# EAGLE board OpenBCI_Board (EAGLE 9.7.0), part 1 of 3
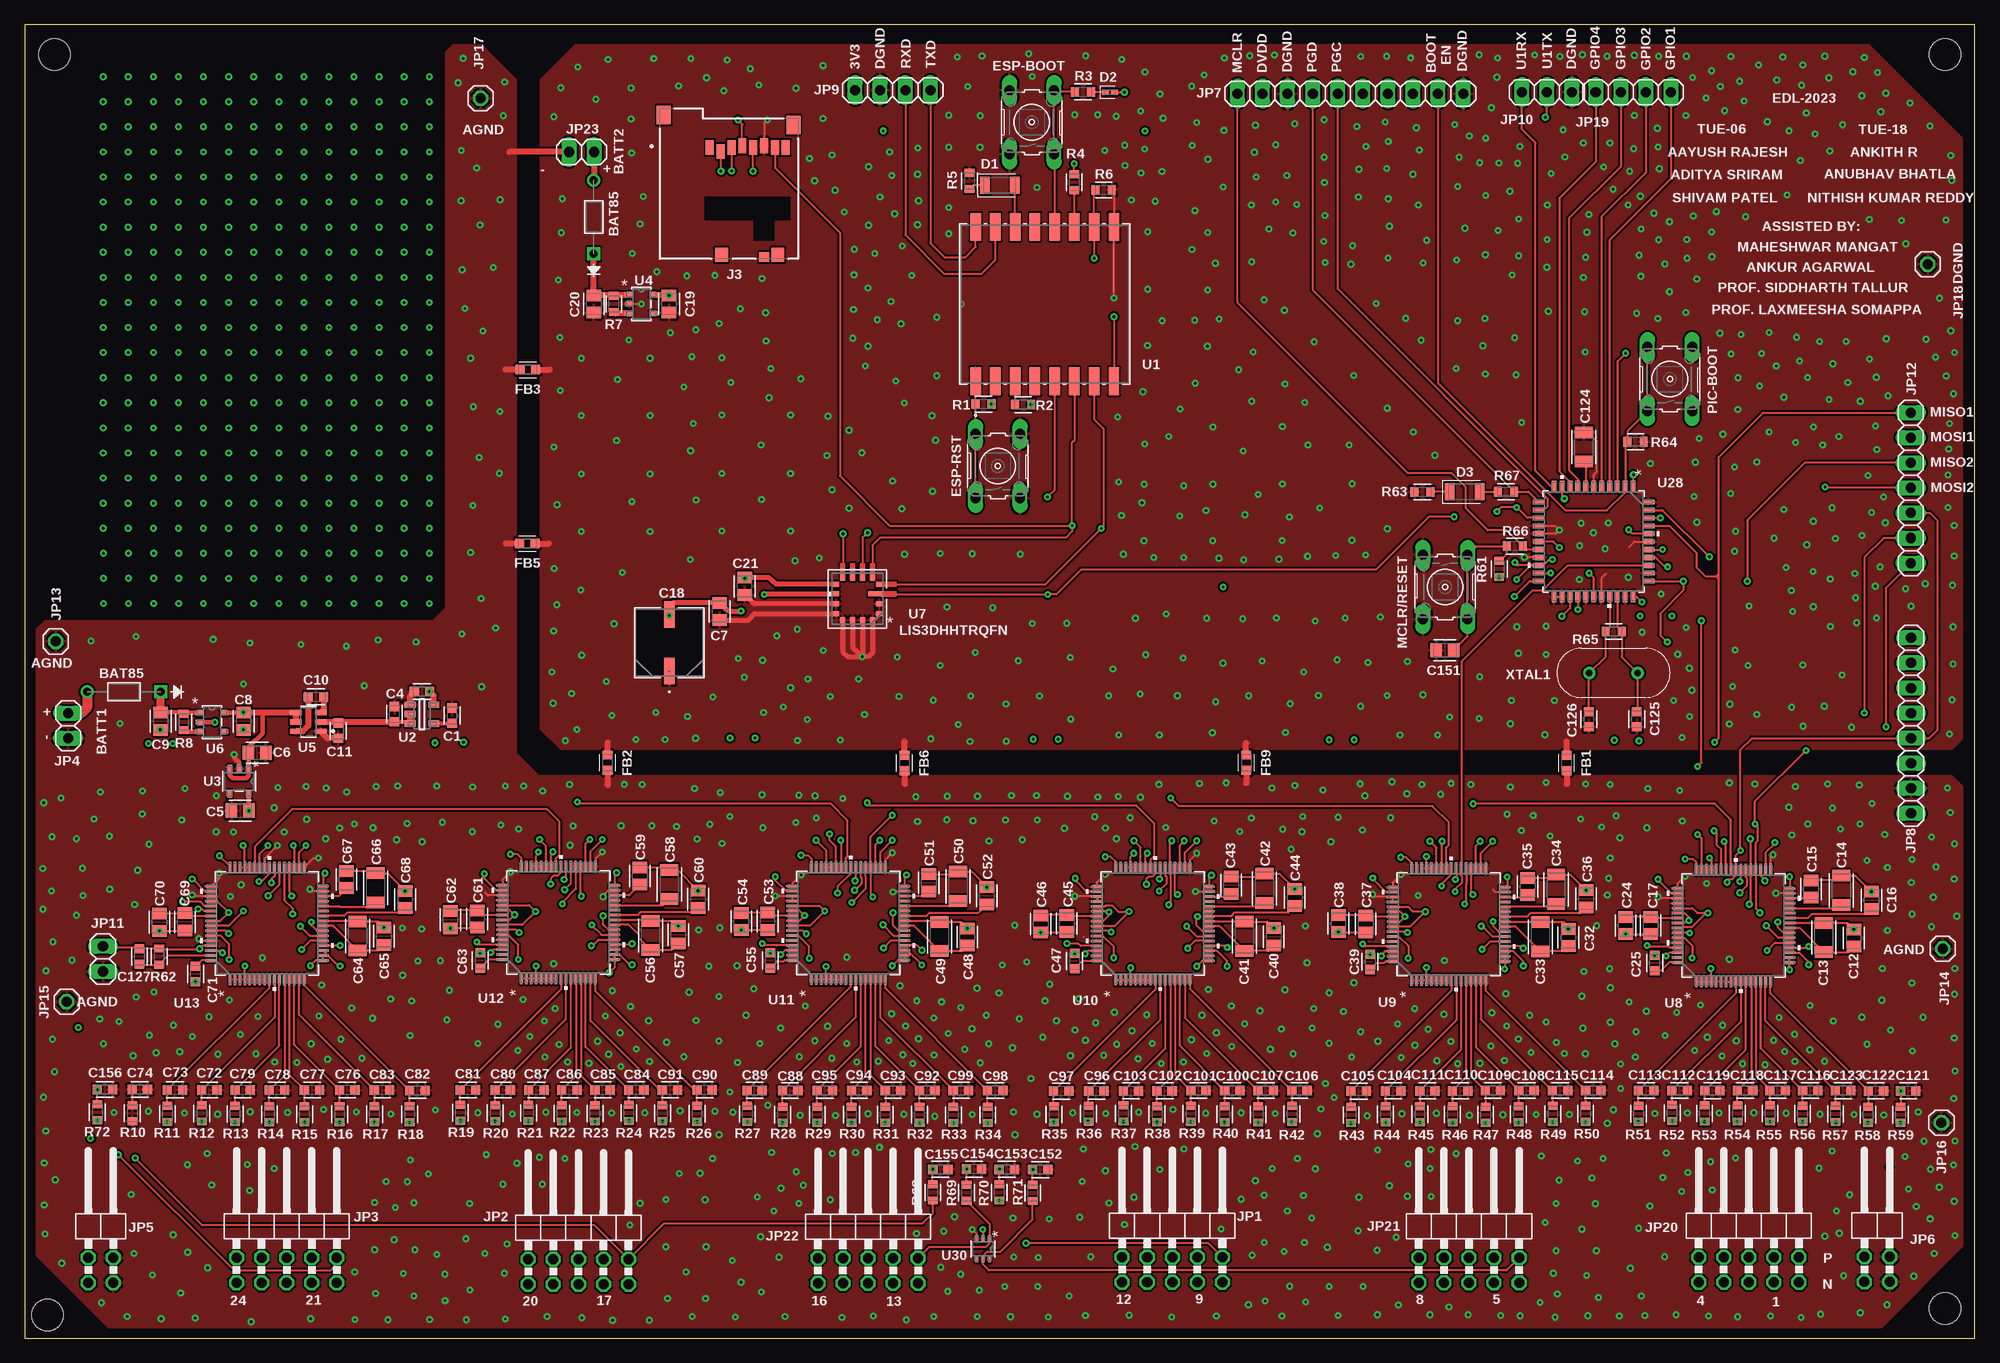
[diagram p5: board, top side]
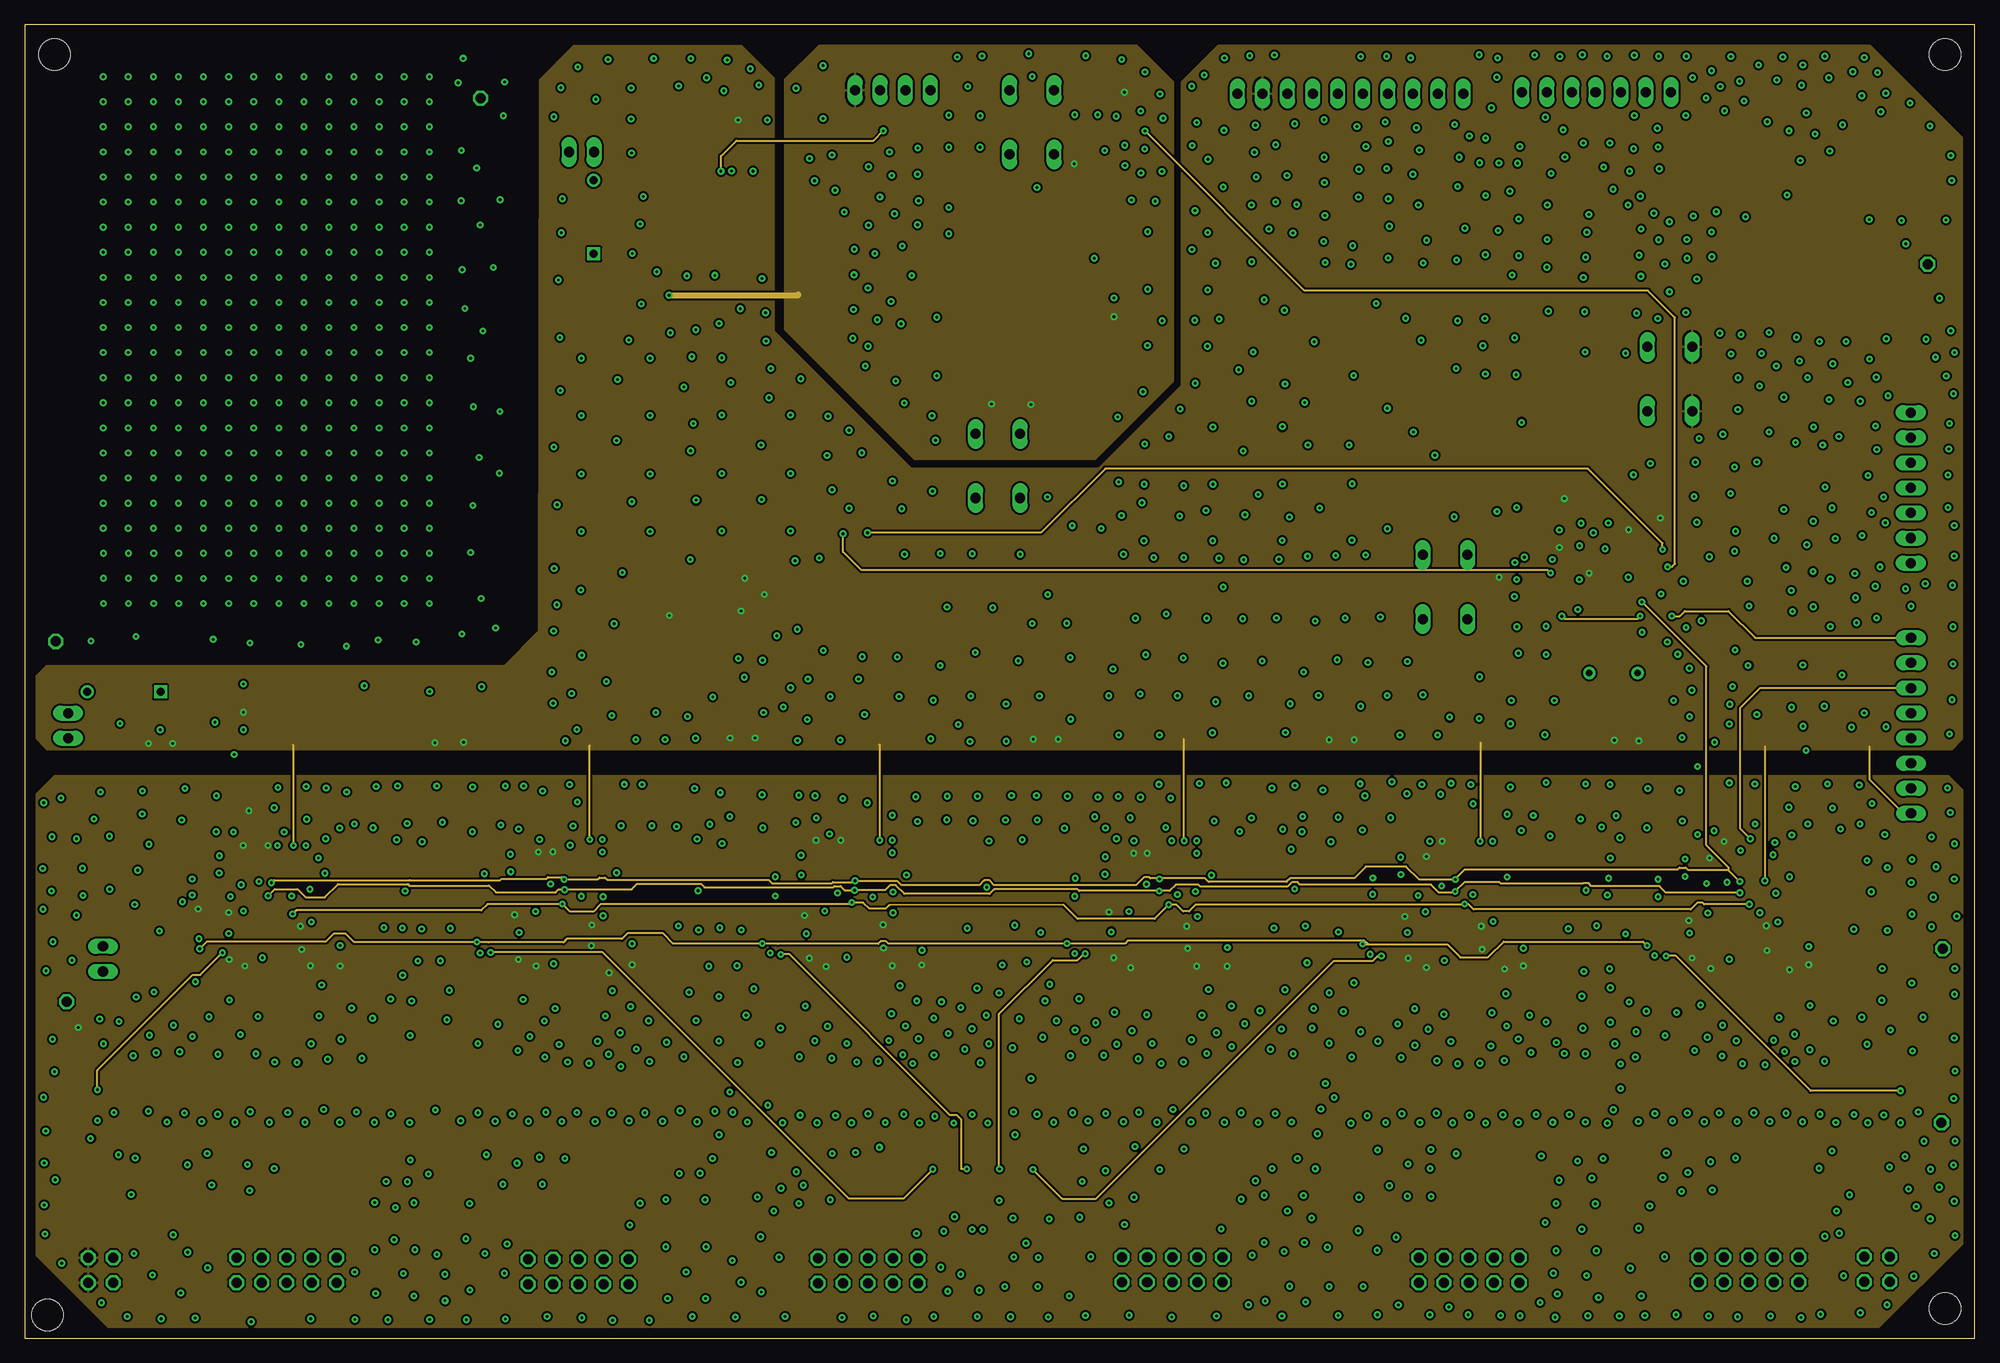
[diagram p6: board, inner layer Route2]
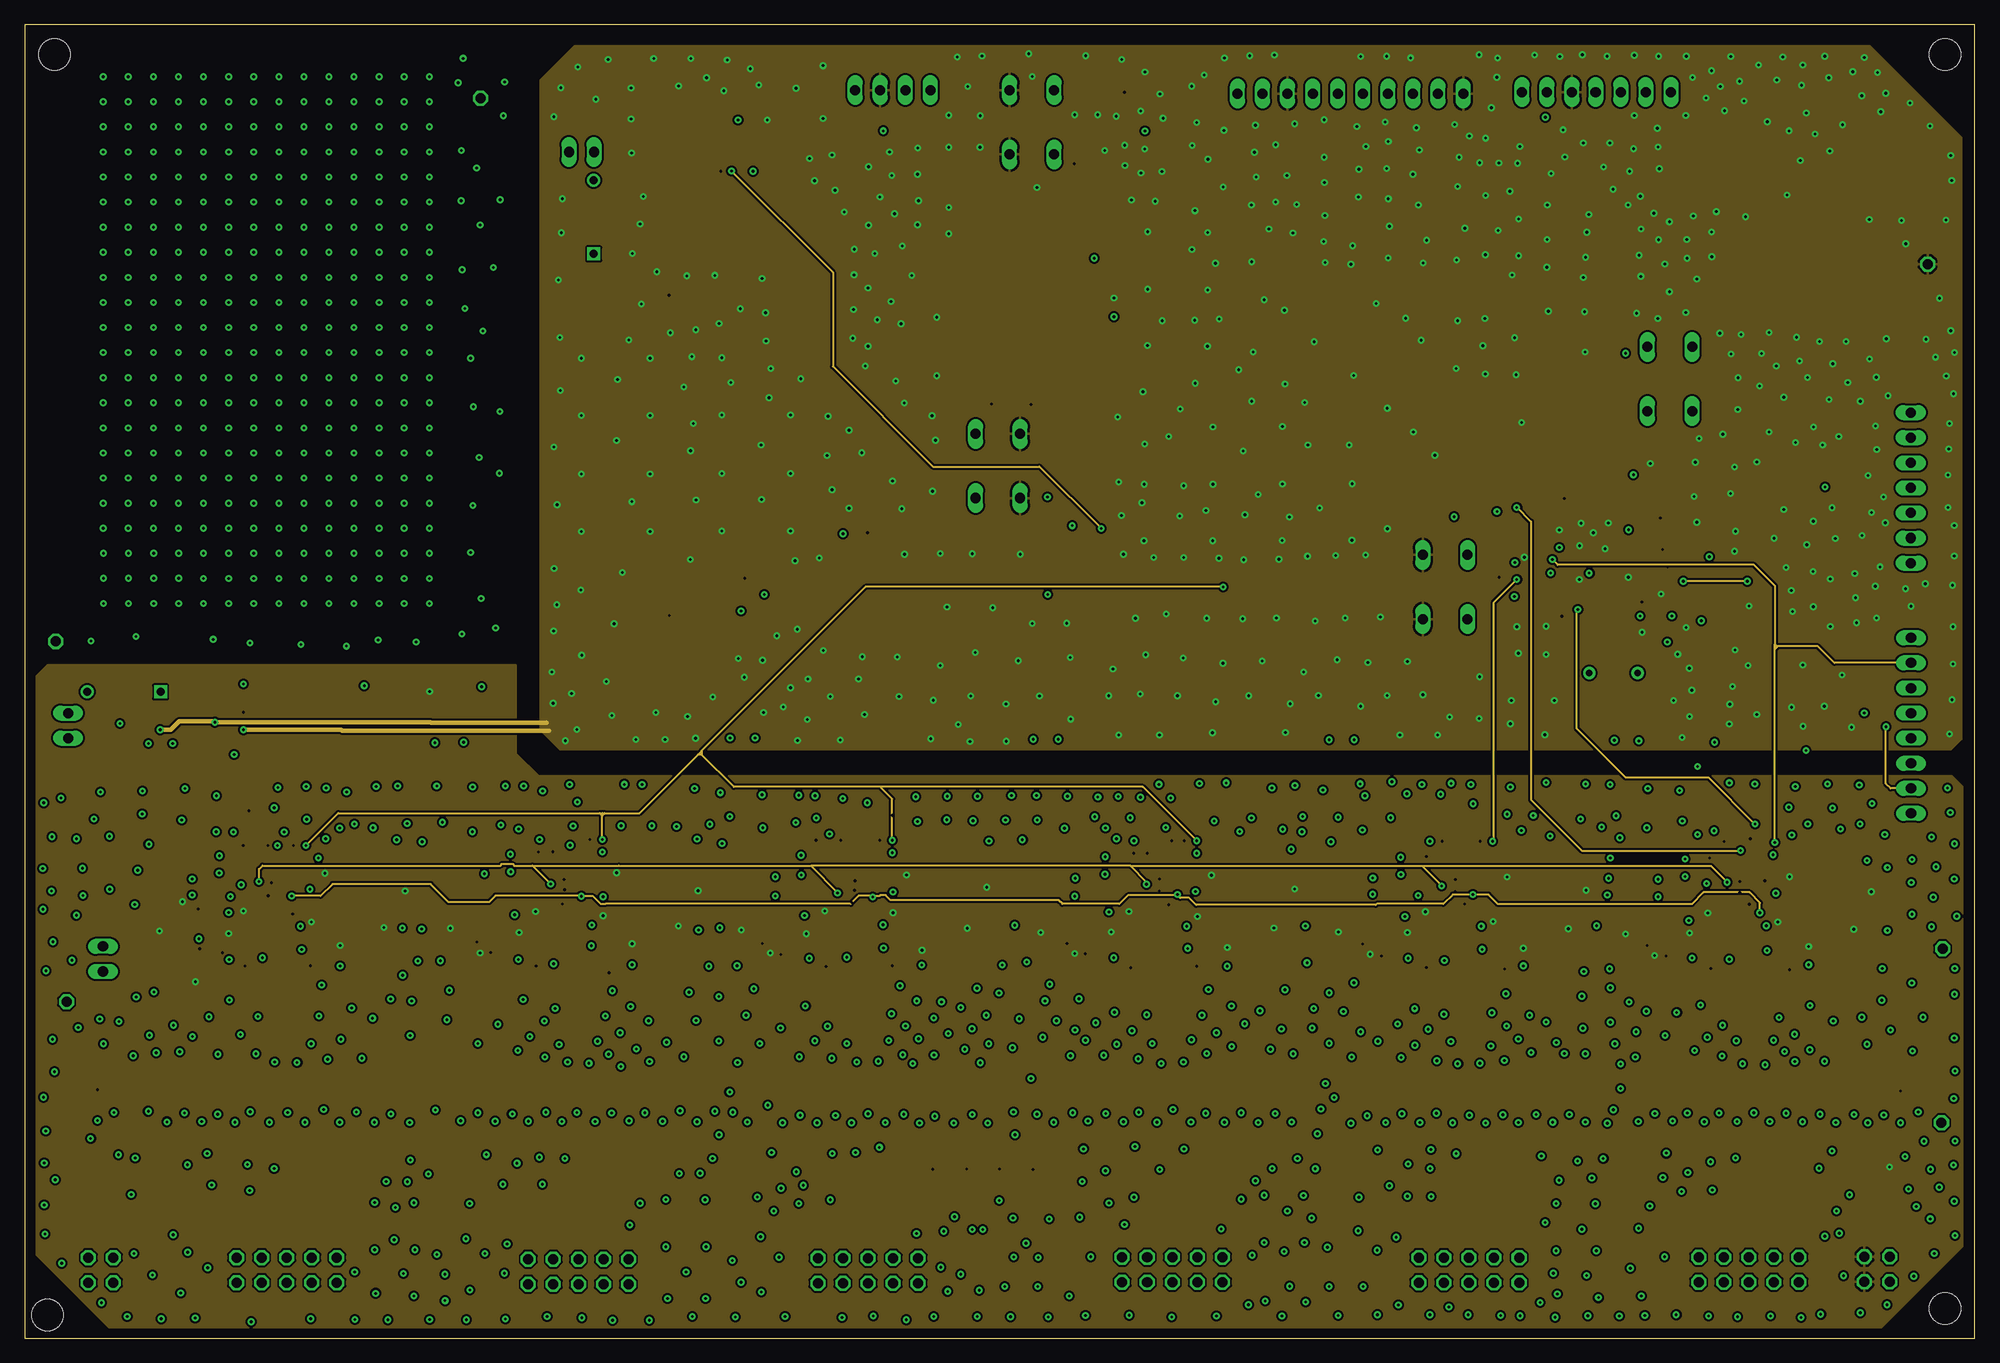
[diagram p7: board, inner layer Route15]
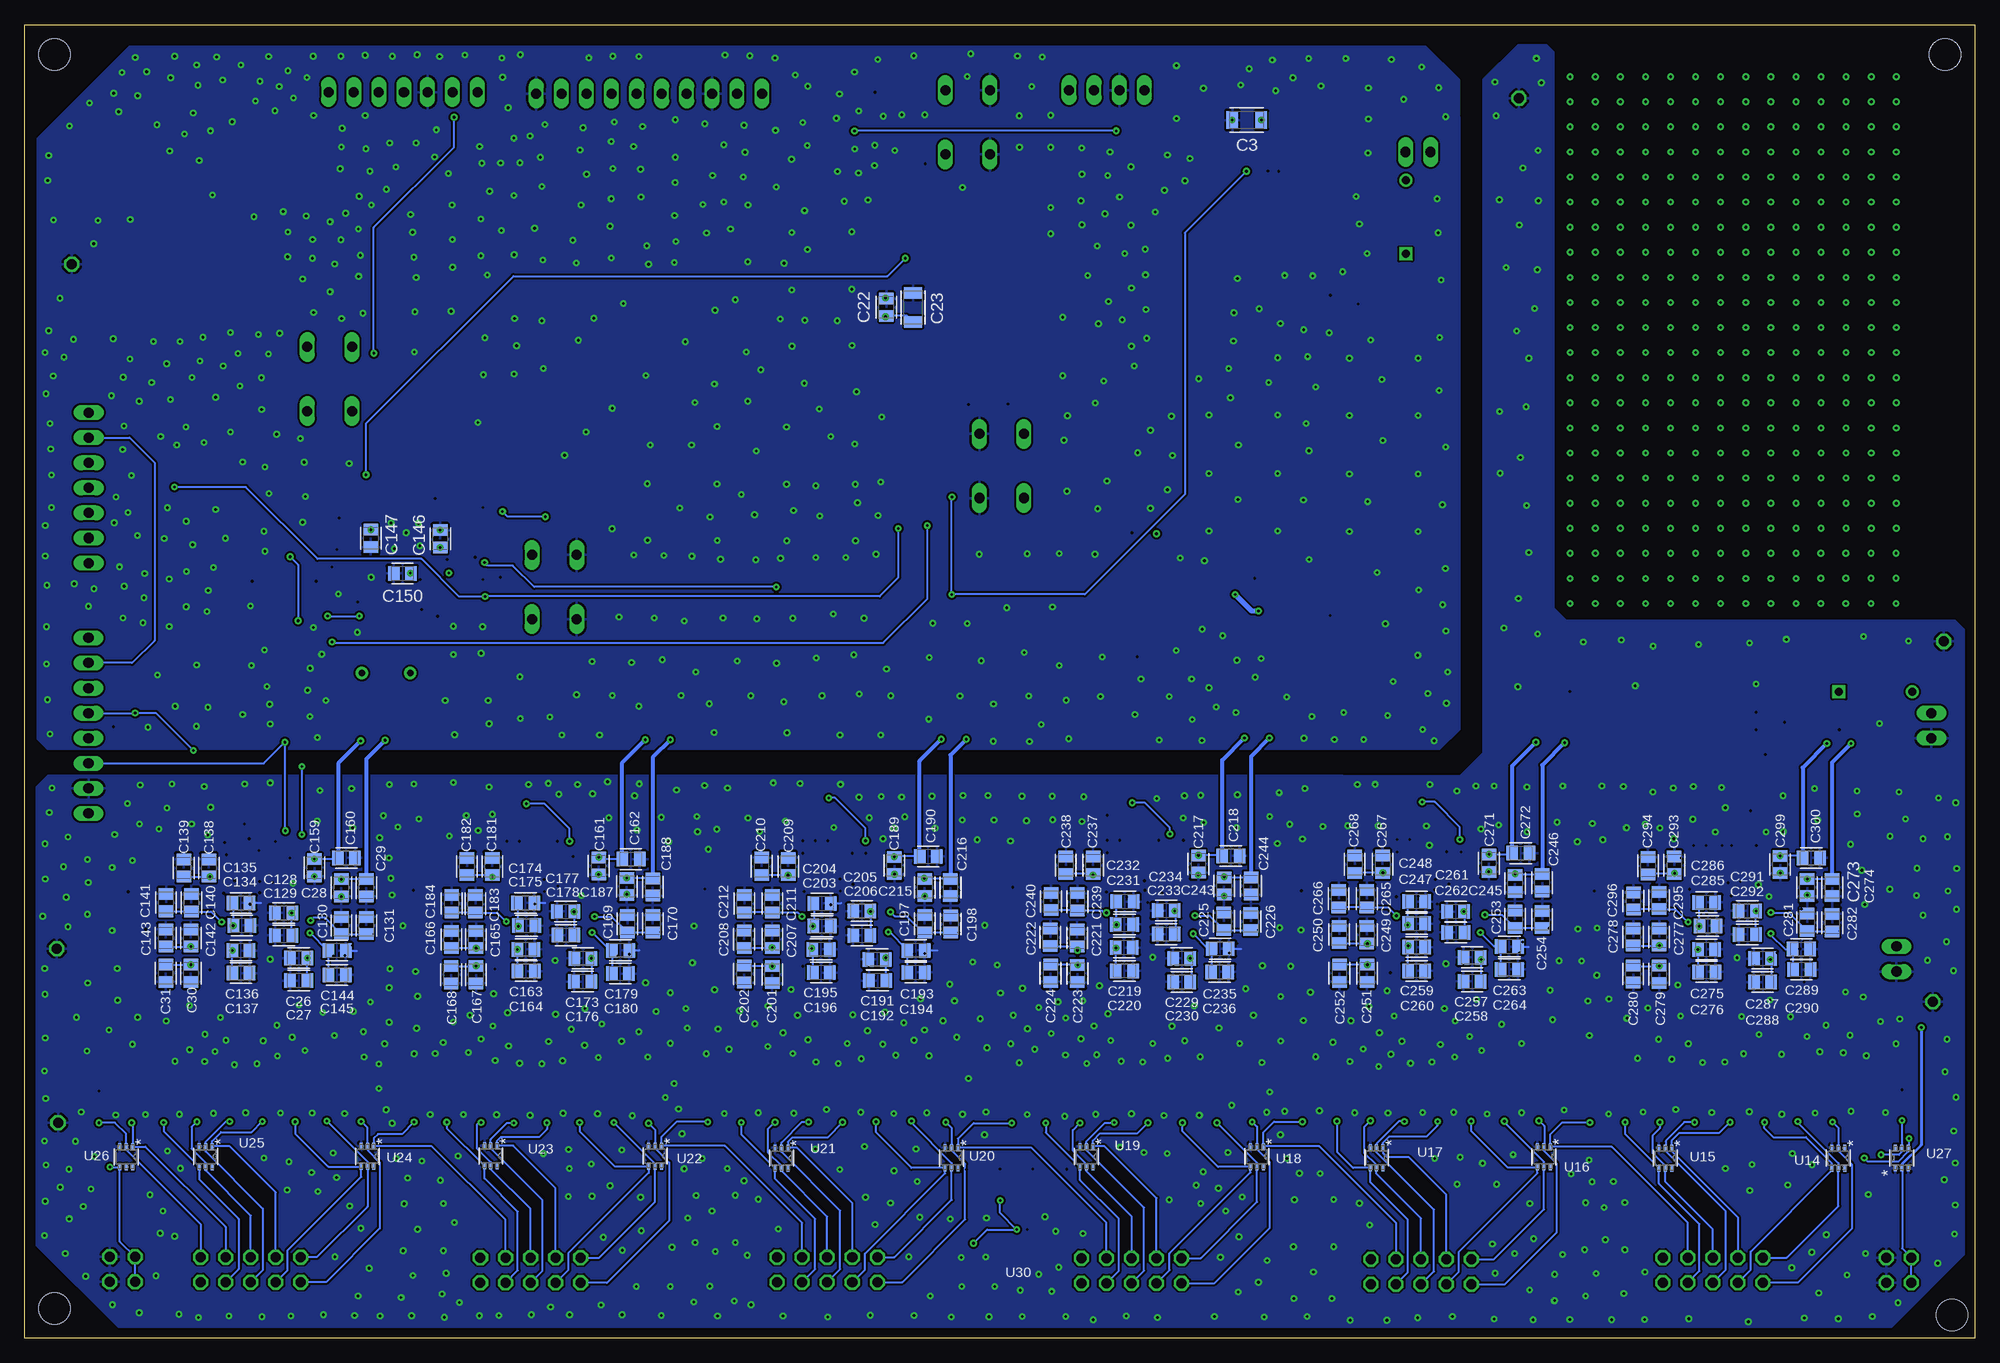
[diagram p8: board, bottom side, seen from below]

Size 197.5 x 133 mm. Coordinates in mm from the lower left corner, seen from the top.
Outline: 0,0 197.5,0 197.5,133 0,133 0,0
Copper layers (((1+2)*15)+16): Top 0.035mm / dielectric 1.5mm / Route2 0.035mm / dielectric 0.15mm / Route15 0.035mm / dielectric 0.2mm / Bottom 0.035mm
Design rules "default *": minimum track width 8mil, minimum drill 10mil, track to track 8mil, track to pad 8mil, pad to pad 8mil, via to via 8mil, smd to smd 8mil, copper to edge 40mil, drill to drill 10mil, minimum pad ring 10mil, minimum via ring 8mil, stop-mask expansion 4mil, vias tented up to drill 0mil, thermal gap 10mil
Holes 3.2 mm at 3,130 194.5,130 194.5,3 2.32,2.35

## Footprints (pad centres in the part's own frame; a part is rotated, then mirrored left to right if it is on the bottom)
CAPC1608X85 = smd 0.921 x 0.97: 1 -0.775,0; 2 0.775,0
CAPC3216X135 = smd 1.165 x 1.815: 1 -1.475,0; 2 1.475,0
CAPC2012X110 = smd 1.165 x 1.465: 1 -0.875,0; 2 0.875,0
CAP_MCVV_A1_MTC-L = smd 2.692 x 1.092: 1 -2.857,0; 2 2.857,0
DO-34_NEX = drill 0.813 pad 1.321 square: 1 0,0 | drill 0.813 pad 1.321: 2 7.442,0
LEDC3216X75N_FLAT-B = smd 0.962 x 1.712: A 1.525,0; C -1.525,0
LEDC1005X25N_FLAT-B = smd 0.7 x 0.5: A 0.45,0; C -0.45,0
B3F-10XX = drill 1.016 long: 1 -3.251,2.261; 2 3.251,2.261; 3 -3.251,-2.261; 4 3.251,-2.261
BEADC1608X95N = smd 0.9 x 0.97: 1 -0.785,0 | smd 0.933 x 0.97: 2 0.769,0
GCT_MEM2051-00-195-00-A_REVD1 = smd 1 x 0.95: CD -3.56,7.425 | smd 0.8 x 1.5: P1 1.94,-3.66; P2 0.84,-3.26; P3 -0.26,-3.66; P4 -1.36,-3.86; P5 -2.46,-3.66; P6 -3.56,-3.86; P7 -4.66,-3.66; P8 -5.76,-3.66 | smd 1.3 x 1.4: S1 -4.95,7.2; S2 0.75,7.2 | smd 1.4 x 1.9: S3 6.6,-6.95; S4 -6.55,-5.95
2X05/90 = drill 1.016 octagon: 1 -5.08,-6.35; 2 -5.08,-3.81; 3 -2.54,-6.35; 4 -2.54,-3.81; 5 0,-6.35; 6 0,-3.81; 7 2.54,-6.35; 8 2.54,-3.81; 9 5.08,-6.35; 10 5.08,-3.81
1X02 = drill 1.016 long: 1 -1.27,0; 2 1.27,0
2X02/90 = drill 1.016 octagon: 1 -1.27,-6.35; 2 -1.27,-3.81; 3 1.27,-6.35; 4 1.27,-3.81
1X10 = drill 1.016 long: 1 -11.43,0; 2 -8.89,0; 3 -6.35,0; 4 -3.81,0; 5 -1.27,0; 6 1.27,0; 7 3.81,0; 8 6.35,0; 9 8.89,0; 10 11.43,0
1X08 = drill 1.016 long: 1 -8.89,0; 2 -6.35,0; 3 -3.81,0; 4 -1.27,0; 5 1.27,0; 6 3.81,0; 7 6.35,0; 8 8.89,0
1X04 = drill 1.016 long: 1 -3.81,0; 2 -1.27,0; 3 1.27,0; 4 3.81,0
1X03 = drill 1.016 long: 1 -2.54,0; 2 0,0; 3 2.54,0
1X07 = drill 1.016 long: 1 -7.62,0; 2 -5.08,0; 3 -2.54,0; 4 0,0; 5 2.54,0; 6 5.08,0; 7 7.62,0
1X01 = drill 1.016 octagon: 1 0,0
RESC1608X60 = smd 0.799 x 0.974: 1 -0.815,0; 2 0.815,0
ESP-07S_RFS-L = smd 2.794 x 1.041: 1 -7.811,7; 2 -7.811,5; 3 -7.811,3; 4 -7.811,1; 5 -7.811,-1; 6 -7.811,-3; 7 -7.811,-5; 8 -7.811,-7; 9 7.811,-7; 10 7.811,-5; 11 7.811,-3; 12 7.811,-1; 13 7.811,1; 14 7.811,3; 15 7.811,5; 16 7.811,7
DBV0005A = smd 1.1 x 0.65: 1 -1.2,0.95; 2 -1.2,0; 3 -1.2,-0.95; 4 1.2,-0.95; 5 1.2,0.95
DDC5_TEX-L = smd 0.8 x 0.457: 1 -1.276,0.95; 2 -1.276,0; 3 -1.276,-0.95; 4 1.276,-0.95; 5 1.276,0.95
SOT_RG1_DIO-L = smd 0.8 x 0.457: 1 -1.251,0.95; 2 -1.251,0; 3 -1.251,-0.95; 4 1.251,-0.95; 5 1.251,0.95
SOT95P280X145-6N = smd 1.21 x 0.58: 1 -1.255,0.95; 2 -1.255,0; 3 -1.255,-0.95; 4 1.255,-0.95; 5 1.255,0; 6 1.255,0.95
QFN_ICLX_STM = smd 1.397 x 0.508: 1 -1.767,-0.5 | smd 0.61 x 0.508: 2 -2.161,-1.5; 7 2.161,-1.5; 8 2.161,-0.5; 9 2.161,0.5; 10 2.161,1.5; 15 -2.161,1.5; 16 -2.161,0.5 | smd 0.508 x 0.61: 3 -1.5,-2.161; 4 -0.5,-2.161; 5 0.5,-2.161; 6 1.5,-2.161; 11 1.5,2.161; 12 0.5,2.161; 13 -0.5,2.161; 14 -1.5,2.161
PAG64-L = smd 1.143 x 0.229: 1 -5.677,3.75; 2 -5.677,3.25; 3 -5.677,2.75; 4 -5.677,2.25; 5 -5.677,1.75; 6 -5.677,1.25; 7 -5.677,0.75; 8 -5.677,0.25; 9 -5.677,-0.25; 10 -5.677,-0.75; 11 -5.677,-1.25; 12 -5.677,-1.75; 13 -5.677,-2.25; 14 -5.677,-2.75; 15 -5.677,-3.25; 16 -5.677,-3.75; 33 5.677,-3.75; 34 5.677,-3.25; 35 5.677,-2.75; 36 5.677,-2.25; 37 5.677,-1.75; 38 5.677,-1.25; 39 5.677,-0.75; 40 5.677,-0.25; 41 5.677,0.25; 42 5.677,0.75; 43 5.677,1.25; 44 5.677,1.75; 45 5.677,2.25; 46 5.677,2.75; 47 5.677,3.25; 48 5.677,3.75 | smd 0.229 x 1.143: 17 -3.75,-5.677; 18 -3.25,-5.677; 19 -2.75,-5.677; 20 -2.25,-5.677; 21 -1.75,-5.677; 22 -1.25,-5.677; 23 -0.75,-5.677; 24 -0.25,-5.677; 25 0.25,-5.677; 26 0.75,-5.677; 27 1.25,-5.677; 28 1.75,-5.677; 29 2.25,-5.677; 30 2.75,-5.677; 31 3.25,-5.677; 32 3.75,-5.677; 49 3.75,5.677; 50 3.25,5.677; 51 2.75,5.677; 52 2.25,5.677; 53 1.75,5.677; 54 1.25,5.677; 55 0.75,5.677; 56 0.25,5.677; 57 -0.25,5.677; 58 -0.75,5.677; 59 -1.25,5.677; 60 -1.75,5.677; 61 -2.25,5.677; 62 -2.75,5.677; 63 -3.25,5.677; 64 -3.75,5.677
DCK6_TEX-L = smd 0.648 x 0.305: 1 -1.035,0.65; 2 -1.035,0; 3 -1.035,-0.65; 4 1.035,-0.65; 5 1.035,0; 6 1.035,0.65
TQFP44_MC_MCH-L = smd 1.168 x 0.457: 1 -5.568,4; 2 -5.568,3.2; 3 -5.568,2.4; 4 -5.568,1.6; 5 -5.568,0.8; 6 -5.568,0; 7 -5.568,-0.8; 8 -5.568,-1.6; 9 -5.568,-2.4; 10 -5.568,-3.2; 11 -5.568,-4; 23 5.568,-4; 24 5.568,-3.2; 25 5.568,-2.4; 26 5.568,-1.6; 27 5.568,-0.8; 28 5.568,0; 29 5.568,0.8; 30 5.568,1.6; 31 5.568,2.4; 32 5.568,3.2; 33 5.568,4 | smd 0.457 x 1.168: 12 -4,-5.568; 13 -3.2,-5.568; 14 -2.4,-5.568; 15 -1.6,-5.568; 16 -0.8,-5.568; 17 0,-5.568; 18 0.8,-5.568; 19 1.6,-5.568; 20 2.4,-5.568; 21 3.2,-5.568; 22 4,-5.568; 34 4,5.568; 35 3.2,5.568; 36 2.4,5.568; 37 1.6,5.568; 38 0.8,5.568; 39 0,5.568; 40 -0.8,5.568; 41 -1.6,5.568; 42 -2.4,5.568; 43 -3.2,5.568; 44 -4,5.568
XTALRR488W45L1150T500H350B = drill 0.657 pad 1.257: 1 -2.44,0; 2 2.44,0

## Placement (x,y rotation side)
C1  10n  [CAPC1608X85]  43.29,63.04 90 top
C2  2.2u  [CAPC1608X85]  40.24,65.48 180 top
C3  10u  [CAPC3216X135]  73.73,123.35 180 bottom
C4  2.2u  [CAPC1608X85]  37.44,63.2 90 top
C5  1u  [CAPC2012X110]  21.82,53.42 180 top
C6  1u  [CAPC2012X110]  23.55,59.28 0 top
C7  0.1u  [CAPC2012X110]  70.37,73.59 270 top
C8  1u  [CAPC2012X110]  22.18,62.48 270 top
C9  1u  [CAPC2012X110]  13.77,62.48 270 top
C10  3.3u  [CAPC1608X85]  29.49,64.95 0 top
C11  3.3u  [CAPC1608X85]  31.76,61.52 270 top
C12  0.1u  [CAPC2012X110]  185.25,40.53 90 top
C13  10u  [CAPC3216X135]  182.2,40.58 90 top
C14  22u  [CAPC3216X135]  183.98,45.36 90 top
C15  1u  [CAPC2012X110]  180.93,45.5 90 top
C16  1u  [CAPC2012X110]  187.03,44.34 90 top
C17  0.1u  [CAPC2012X110]  164.67,41.8 270 top
C18  10u  [CAP_MCVV_A1_MTC-L]  65.29,70.42 90 top
C19  1u  [CAPC2012X110]  65.26,104.72 270 top
C20  1u  [CAPC2012X110]  57.64,104.72 270 top
C21  0.1u  [CAPC2012X110]  72.91,76.13 270 top
C22  0.1u  [CAPC2012X110]  110.24,104.38 90 bottom
C23  10u  [CAPC3216X135]  107.52,104.38 90 bottom
C24  1u  [CAPC2012X110]  162.13,41.8 270 top
C25  100p  [CAPC1608X85]  165.08,37.99 90 top
C26  0.1u  [CAPC2012X110]  169.75,38.5 180 bottom
C27  1u  [CAPC2012X110]  169.75,36.21 180 bottom
C28  0.1u  [CAPC2012X110]  165.44,45.61 270 bottom
C29  1u  [CAPC2012X110]  162.9,45.61 270 bottom
C30  0.1u  [CAPC2012X110]  180.68,36.95 270 bottom
C31  1u  [CAPC2012X110]  183.22,36.95 270 bottom
C32  0.1u  [CAPC2012X110]  156.34,40.58 90 top
C33  10u  [CAPC3216X135]  153.5,40.66 90 top
C34  22u  [CAPC3216X135]  155.1,45.46 90 top
C35  1u  [CAPC2012X110]  152.2,45.74 90 top
C36  1u  [CAPC2012X110]  158.12,44.49 90 top
C37  0.1u  [CAPC2012X110]  135.82,41.95 270 top
C38  1u  [CAPC2012X110]  133.05,42 270 top
C39  100p  [CAPC1608X85]  136.25,38.12 90 top
C40  0.1u  [CAPC2012X110]  126.51,40.66 90 top
C41  10u  [CAPC3216X135]  123.53,40.71 90 top
C42  22u  [CAPC3216X135]  125.56,45.56 90 top
C43  1u  [CAPC2012X110]  122.2,45.86 90 top
C44  1u  [CAPC2012X110]  128.63,44.62 90 top
C45  0.1u  [CAPC2012X110]  105.54,42 270 top
C46  1u  [CAPC2012X110]  102.9,41.95 270 top
C47  100p  [CAPC1608X85]  106.33,38.19 90 top
C48  0.1u  [CAPC2012X110]  95.46,40.63 90 top
C49  10u  [CAPC3216X135]  92.64,40.68 90 top
C50  22u  [CAPC3216X135]  94.52,45.76 90 top
C51  1u  [CAPC2012X110]  91.55,46.12 90 top
C52  1u  [CAPC2012X110]  97.44,44.8 90 top
C53  0.1u  [CAPC2012X110]  75.24,42.23 270 top
C54  1u  [CAPC2012X110]  72.57,42.21 270 top
C55  100p  [CAPC1608X85]  75.52,38.24 90 top
C56  10u  [CAPC3216X135]  63.38,40.78 90 top
C57  0.1u  [CAPC2012X110]  66.2,40.86 90 top
C58  22u  [CAPC3216X135]  65.28,45.94 90 top
C59  1u  [CAPC2012X110]  62.29,46.8 90 top
C60  1u  [CAPC2012X110]  68.2,44.44 90 top
C61  0.1u  [CAPC2012X110]  45.83,42.46 270 top
C62  1u  [CAPC2012X110]  43.11,42.38 270 top
C63  100p  [CAPC1608X85]  46.13,38.24 90 top
C64  10u  [CAPC3216X135]  33.71,40.74 90 top
C65  0.1u  [CAPC2012X110]  36.38,40.71 90 top
C66  22u  [CAPC3216X135]  35.54,45.61 90 top
C67  1u  [CAPC2012X110]  32.6,46.45 90 top
C68  1u  [CAPC2012X110]  38.54,44.42 90 top
C69  0.1u  [CAPC2012X110]  16.24,42.16 270 top
C70  1u  [CAPC2012X110]  13.65,42.11 270 top
C71  100p  [CAPC1608X85]  17.31,36.88 270 top
C72  10p  [CAPC1608X85]  18.7,25.13 0 top
C73  10p  [CAPC1608X85]  15.22,25.15 0 top
C74  10p  [CAPC1608X85]  11.66,25.18 0 top
C76  10p  [CAPC1608X85]  32.67,25.13 0 top
C77  10p  [CAPC1608X85]  29.11,25.13 0 top
C78  10p  [CAPC1608X85]  25.55,25.13 0 top
C79  10p  [CAPC1608X85]  22.07,25.13 0 top
C80  10p  [CAPC1608X85]  48.41,25.13 0 top
C81  10p  [CAPC1608X85]  44.88,25.13 0 top
C82  10p  [CAPC1608X85]  39.78,25.1 0 top
C83  10p  [CAPC1608X85]  36.2,25.13 0 top
C84  10p  [CAPC1608X85]  61.93,25.15 0 top
C85  10p  [CAPC1608X85]  58.52,25.15 0 top
C86  10p  [CAPC1608X85]  55.17,25.13 0 top
C87  10p  [CAPC1608X85]  51.82,25.13 0 top
C88  10p  [CAPC1608X85]  77.52,25.08 0 top
C89  10p  [CAPC1608X85]  73.92,25.1 0 top
C90  10p  [CAPC1608X85]  68.86,25.15 0 top
C91  10p  [CAPC1608X85]  65.36,25.15 0 top
C92  10p  [CAPC1608X85]  91.39,25.1 0 top
C93  10p  [CAPC1608X85]  87.94,25.1 0 top
C94  10p  [CAPC1608X85]  84.51,25.1 0 top
C95  10p  [CAPC1608X85]  81.03,25.1 0 top
C96  10p  [CAPC1608X85]  108.54,25.03 0 top
C97  10p  [CAPC1608X85]  104.98,25.03 0 top
C98  10p  [CAPC1608X85]  98.3,25.08 0 top
C99  10p  [CAPC1608X85]  94.82,25.1 0 top
C100  10p  [CAPC1608X85]  122.3,25.08 0 top
C101  10p  [CAPC1608X85]  118.87,25.08 0 top
C102  10p  [CAPC1608X85]  115.44,25.05 0 top
C103  10p  [CAPC1608X85]  112.04,25.05 0 top
C104  10p  [CAPC1608X85]  138.58,25.05 0 top
C105  10p  [CAPC1608X85]  135.1,25.03 0 top
C106  10p  [CAPC1608X85]  129.11,25.08 0 top
C107  10p  [CAPC1608X85]  125.68,25.08 0 top
C108  10p  [CAPC1608X85]  152.1,25.08 0 top
C109  10p  [CAPC1608X85]  148.69,25.08 0 top
C110  10p  [CAPC1608X85]  145.37,25.05 0 top
C111  10p  [CAPC1608X85]  142.06,25.05 0 top
C112  10p  [CAPC1608X85]  167.61,25.08 0 top
C113  10p  [CAPC1608X85]  164.21,25.08 0 top
C114  10p  [CAPC1608X85]  158.85,25.1 0 top
C115  10p  [CAPC1608X85]  155.5,25.08 0 top
C116  10p  [CAPC1608X85]  180.82,25.08 0 top
C117  10p  [CAPC1608X85]  177.52,25.08 0 top
C118  10p  [CAPC1608X85]  174.22,25.08 0 top
C119  10p  [CAPC1608X85]  170.92,25.07 0 top
C121  10p  [CAPC1608X85]  190.76,25.05 0 top
C122  10p  [CAPC1608X85]  187.48,25.05 0 top
C123  10p  [CAPC1608X85]  184.15,25.08 0 top
C124  10u  [CAPC3216X135]  157.9,90.23 270 top
C125  15p  [CAPC1608X85]  163.26,62.68 270 top
C126  15p  [CAPC1608X85]  158.41,62.68 270 top
C127  1.5n  [CAPC1608X85]  11.62,38.65 90 top
C128  0.1u  [CAPC2012X110]  171.28,43.07 180 bottom
C129  1u  [CAPC2012X110]  171.28,40.78 180 bottom
C130  0.1u  [CAPC2012X110]  165.44,41.8 90 bottom
C131  1u  [CAPC2012X110]  162.9,41.8 90 bottom
C134  0.1u  [CAPC2012X110]  175.49,41.8 0 bottom
C135  1u  [CAPC2012X110]  175.6,44.09 0 bottom
C136  0.1u  [CAPC2012X110]  175.6,39.26 0 bottom
C137  1u  [CAPC2012X110]  175.6,36.97 0 bottom
C138  0.1u  [CAPC2012X110]  178.85,47.62 90 bottom
C139  1u  [CAPC2012X110]  181.39,47.62 90 bottom
C140  0.1u  [CAPC2012X110]  180.62,44.09 90 bottom
C141  1u  [CAPC2012X110]  183.19,44.11 90 bottom
C142  0.1u  [CAPC2012X110]  180.68,40.53 90 bottom
C143  1u  [CAPC2012X110]  183.22,40.53 90 bottom
C144  0.1u  [CAPC2012X110]  165.87,39.26 0 bottom
C145  1u  [CAPC2012X110]  165.87,36.8 0 bottom
C146  0.1u  [CAPC2012X110]  155.41,80.94 90 bottom
C147  0.1u  [CAPC2012X110]  162.45,80.99 270 bottom
C150  0.1u  [CAPC2012X110]  159.25,77.44 180 bottom
C151  0.1u  [CAPC2012X110]  143.83,69.66 0 top
C152  10p  [CAPC1608X85]  102.85,17.07 0 top
C153  10p  [CAPC1608X85]  99.47,17.1 0 top
C154  10p  [CAPC1608X85]  96.14,17.13 0 top
C155  10p  [CAPC1608X85]  92.74,17.1 0 top
C156  10p  [CAPC1608X85]  8.12,25.18 0 top
C159  0.1u  [CAPC2012X110]  168.15,47.64 270 bottom
C160  1u  [CAPC2012X110]  164.93,48.63 0 bottom
C161  0.1u  [CAPC2012X110]  139.37,47.82 270 bottom
C162  1u  [CAPC2012X110]  136.1,48.51 0 bottom
C163  0.1u  [CAPC2012X110]  146.74,39.39 0 bottom
C164  1u  [CAPC2012X110]  146.72,37.18 0 bottom
C165  0.1u  [CAPC2012X110]  151.8,40.38 90 bottom
C166  1u  [CAPC2012X110]  154.28,40.38 90 bottom
C167  0.1u  [CAPC2012X110]  151.8,36.8 270 bottom
C168  1u  [CAPC2012X110]  154.31,36.8 270 bottom
C169  0.1u  [CAPC2012X110]  136.45,41.98 90 bottom
C170  1u  [CAPC2012X110]  133.89,41.98 90 bottom
C173  0.1u  [CAPC2012X110]  140.98,38.47 180 bottom
C174  1u  [CAPC2012X110]  146.77,44.09 0 bottom
C175  0.1u  [CAPC2012X110]  146.66,41.77 0 bottom
C176  1u  [CAPC2012X110]  141,36.11 180 bottom
C177  0.1u  [CAPC2012X110]  142.73,43.22 180 bottom
C178  1u  [CAPC2012X110]  142.7,40.81 180 bottom
C179  0.1u  [CAPC2012X110]  137.14,39.29 0 bottom
C180  1u  [CAPC2012X110]  137.17,36.92 0 bottom
C181  0.1u  [CAPC2012X110]  150.14,47.77 90 bottom
C182  1u  [CAPC2012X110]  152.71,47.77 90 bottom
C183  0.1u  [CAPC2012X110]  151.85,43.98 90 bottom
C184  1u  [CAPC2012X110]  154.26,44.01 90 bottom
C187  0.1u  [CAPC2012X110]  136.53,45.74 270 bottom
C188  1u  [CAPC2012X110]  133.89,45.69 270 bottom
C189  0.1u  [CAPC2012X110]  109.43,47.87 270 bottom
C190  1u  [CAPC2012X110]  106,48.78 0 bottom
C191  0.1u  [CAPC2012X110]  111.18,38.37 180 bottom
C192  1u  [CAPC2012X110]  111.13,36.21 180 bottom
C193  0.1u  [CAPC2012X110]  107.24,39.29 0 bottom
C194  1u  [CAPC2012X110]  107.24,37.05 0 bottom
C195  0.1u  [CAPC2012X110]  116.85,39.39 0 bottom
C196  1u  [CAPC2012X110]  116.82,37.02 0 bottom
C197  0.1u  [CAPC2012X110]  106.35,41.98 90 bottom
C198  1u  [CAPC2012X110]  103.71,41.95 90 bottom
C201  0.1u  [CAPC2012X110]  121.8,36.82 270 bottom
C202  1u  [CAPC2012X110]  124.64,36.87 270 bottom
C203  0.1u  [CAPC2012X110]  116.74,41.72 0 bottom
C204  1u  [CAPC2012X110]  116.74,44.04 0 bottom
C205  0.1u  [CAPC2012X110]  112.73,43.25 180 bottom
C206  1u  [CAPC2012X110]  112.73,40.78 180 bottom
C207  0.1u  [CAPC2012X110]  121.8,40.4 90 bottom
C208  1u  [CAPC2012X110]  124.64,40.4 90 bottom
C209  0.1u  [CAPC2012X110]  120.17,47.77 90 bottom
C210  1u  [CAPC2012X110]  122.86,47.79 90 bottom
C211  0.1u  [CAPC2012X110]  121.8,44.01 90 bottom
C212  1u  [CAPC2012X110]  124.62,44.01 90 bottom
C215  0.1u  [CAPC2012X110]  106.35,45.64 270 bottom
C216  1u  [CAPC2012X110]  103.74,45.64 270 bottom
C217  0.1u  [CAPC2012X110]  78.62,48.02 270 bottom
C218  1u  [CAPC2012X110]  75.34,48.84 0 bottom
C219  0.1u  [CAPC2012X110]  86.14,39.56 0 bottom
C220  1u  [CAPC2012X110]  86.11,37.2 0 bottom
C221  0.1u  [CAPC2012X110]  90.91,40.53 90 bottom
C222  1u  [CAPC2012X110]  93.63,40.61 90 bottom
C223  0.1u  [CAPC2012X110]  90.89,36.92 270 bottom
C224  1u  [CAPC2012X110]  93.6,36.95 270 bottom
C225  0.1u  [CAPC2012X110]  76.05,42.23 90 bottom
C226  1u  [CAPC2012X110]  73.33,42.21 90 bottom
C229  0.1u  [CAPC2012X110]  80.32,38.47 180 bottom
C230  1u  [CAPC2012X110]  80.32,36.08 180 bottom
C231  0.1u  [CAPC2012X110]  86.11,41.9 0 bottom
C232  1u  [CAPC2012X110]  86.06,44.21 0 bottom
C233  0.1u  [CAPC2012X110]  81.89,40.91 180 bottom
C234  1u  [CAPC2012X110]  81.89,43.3 180 bottom
C235  0.1u  [CAPC2012X110]  76.43,39.44 0 bottom
C236  1u  [CAPC2012X110]  76.48,37.1 0 bottom
C237  0.1u  [CAPC2012X110]  89.29,47.9 90 bottom
C238  1u  [CAPC2012X110]  92.05,47.9 90 bottom
C239  0.1u  [CAPC2012X110]  90.89,44.19 90 bottom
C240  1u  [CAPC2012X110]  93.55,44.21 90 bottom
C243  0.1u  [CAPC2012X110]  76.03,45.79 270 bottom
C244  1u  [CAPC2012X110]  73.31,45.79 270 bottom
C245  0.1u  [CAPC2012X110]  46.56,46.04 270 bottom
C246  1u  [CAPC2012X110]  43.82,46.12 270 bottom
C247  0.1u  [CAPC2012X110]  56.52,41.98 0 bottom
C248  1u  [CAPC2012X110]  56.52,44.21 0 bottom
C249  0.1u  [CAPC2012X110]  61.57,40.86 90 bottom
C250  1u  [CAPC2012X110]  64.37,40.89 90 bottom
C251  0.1u  [CAPC2012X110]  61.55,36.95 270 bottom
C252  1u  [CAPC2012X110]  64.34,36.95 270 bottom
C253  0.1u  [CAPC2012X110]  46.56,42.43 90 bottom
C254  1u  [CAPC2012X110]  43.82,42.41 90 bottom
C257  0.1u  [CAPC2012X110]  50.91,38.57 180 bottom
C258  1u  [CAPC2012X110]  50.91,36.14 180 bottom
C259  0.1u  [CAPC2012X110]  56.52,39.62 0 bottom
C260  1u  [CAPC2012X110]  56.52,37.2 0 bottom
C261  0.1u  [CAPC2012X110]  52.58,43.2 180 bottom
C262  1u  [CAPC2012X110]  52.56,41.09 180 bottom
C263  0.1u  [CAPC2012X110]  47.15,39.67 0 bottom
C264  1u  [CAPC2012X110]  47.15,37.35 0 bottom
C265  0.1u  [CAPC2012X110]  61.57,44.49 90 bottom
C266  1u  [CAPC2012X110]  64.42,44.49 90 bottom
C267  0.1u  [CAPC2012X110]  59.97,48 90 bottom
C268  1u  [CAPC2012X110]  62.79,48 90 bottom
C271  0.1u  [CAPC2012X110]  49.2,48.1 270 bottom
C272  1u  [CAPC2012X110]  45.98,49.12 0 bottom
C273  0.1u  [CAPC2012X110]  16.98,45.64 270 bottom
C274  1u  [CAPC2012X110]  14.44,45.64 270 bottom
C275  0.1u  [CAPC2012X110]  27.16,39.36 0 bottom
C276  1u  [CAPC2012X110]  27.15,37.1 0 bottom
C277  0.1u  [CAPC2012X110]  31.96,40.63 90 bottom
C278  1u  [CAPC2012X110]  34.6,40.63 90 bottom
C279  0.1u  [CAPC2012X110]  31.96,36.85 270 bottom
C280  1u  [CAPC2012X110]  34.6,36.88 270 bottom
C281  0.1u  [CAPC2012X110]  16.98,42.11 90 bottom
C282  1u  [CAPC2012X110]  14.44,42.08 90 bottom
C285  0.1u  [CAPC2012X110]  27.01,41.75 0 bottom
C286  1u  [CAPC2012X110]  27.16,44.14 0 bottom
C287  0.1u  [CAPC2012X110]  21.5,38.45 180 bottom
C288  1u  [CAPC2012X110]  21.5,36.06 180 bottom
C289  0.1u  [CAPC2012X110]  17.56,39.39 0 bottom
C290  1u  [CAPC2012X110]  17.53,37.33 0 bottom
C291  0.1u  [CAPC2012X110]  23.05,43.28 180 bottom
C292  1u  [CAPC2012X110]  23.05,40.89 180 bottom
C293  0.1u  [CAPC2012X110]  30.44,47.9 90 bottom
C294  1u  [CAPC2012X110]  33.1,47.85 90 bottom
C295  0.1u  [CAPC2012X110]  31.96,44.32 90 bottom
C296  1u  [CAPC2012X110]  34.58,44.27 90 bottom
C299  0.1u  [CAPC2012X110]  19.72,47.98 270 bottom
C300  1u  [CAPC2012X110]  16.57,48.64 0 bottom
CR1  BAT85  [DO-34_NEX]  13.77,65.46 180 top
CR2  BAT85  [DO-34_NEX]  57.64,109.8 90 top
D1  LED_BLUE  [LEDC3216X75N_FLAT-B]  98.76,116.75 0 top
D2  LED_BLUE  [LEDC1005X25N_FLAT-B]  109.91,126.17 0 top
D3  LED_BLUE  [LEDC3216X75N_FLAT-B]  145.83,85.72 0 top
ESP-BOOT  [B3F-10XX]  102,123.13 90 top
ESP-RST  [B3F-10XX]  98.56,88.33 90 top
FB1  FERRITE_BEAD  [BEADC1608X95N]  156.16,58.24 270 top
FB2  FERRITE_BEAD  [BEADC1608X95N]  59.03,58.27 270 top
FB3  FERRITE_BEAD  [BEADC1608X95N]  50.96,98.07 180 top
FB5  FERRITE_BEAD  [BEADC1608X95N]  50.91,80.47 180 top
FB6  FERRITE_BEAD  [BEADC1608X95N]  89.11,58.24 270 top
FB9  FERRITE_BEAD  [BEADC1608X95N]  123.73,58.27 270 top
J3  SDCARD  [GCT_MEM2051-00-195-00-A_REVD1]  71.32,116.9 180 top
JP1  PINHD-2X5/90  [2X05/90]  116.22,12.03 0 top
JP2  PINHD-2X5/90  [2X05/90]  56.08,11.82 0 top
JP3  PINHD-2X5/90  [2X05/90]  26.54,11.98 0 top
JP4  PINHD-1X2  [1X02]  4.4,62.03 270 top
JP5  PINHD-2X2/90  [2X02/90]  7.71,11.98 0 top
JP6  PINHD-2X2/90  [2X02/90]  187.6,12.05 0 top
JP7  PINHD-1X10  [1X10]  134.25,126.02 0 top
JP8  PINHD-1X8  [1X08]  191.04,62.03 90 top
JP9  PINHD-1X4  [1X04]  87.91,126.38 0 top
JP10  PINHD-1X3  [1X03]  154.17,126.18 0 top
JP11  PINHD-1X2  [1X02]  7.93,38.4 90 top
JP12  PINHD-1X7  [1X07]  191.01,86.11 270 top
JP13  PINHD-1X1  [1X01]  3.13,70.55 0 top
JP14  PINHD-1X1  [1X01]  194.24,39.45 0 top
JP15  PINHD-1X1  [1X01]  4.24,34.06 0 top
JP16  PINHD-1X1  [1X01]  194.13,21.83 0 top
JP17  AGND  [1X01]  46.16,125.55 0 top
JP18  PINHD-1X1  [1X01]  192.71,108.76 0 top
JP19  PINHD-1X4  [1X04]  162.91,126.18 180 top
JP20  PINHD-2X5/90  [2X05/90]  174.61,12.03 0 top
JP21  PINHD-2X5/90  [2X05/90]  146.27,11.98 0 top
JP22  PINHD-2X5/90  [2X05/90]  85.41,11.93 0 top
JP23  PINHD-1X2  [1X02]  56.39,120.11 180 top
MCLR/RESET  [B3F-10XX]  143.86,76.06 270 top
PIC-BOOT  PIC-BOOT  [B3F-10XX]  166.61,97.12 90 top
R1  10k  [RESC1608X60]  97.11,94.58 0 top
R2  10k  [RESC1608X60]  101.12,94.53 0 top
R3  1k  [RESC1608X60]  107.19,126.2 0 top
R4  10k  [RESC1608X60]  106.29,117.06 90 top
R5  1k  [RESC1608X60]  95.69,117.18 90 top
R6  10k  [RESC1608X60]  109.28,116.27 180 top
R7  10k  [RESC1608X60]  59.67,104.72 270 top
R8  10k  [RESC1608X60]  16.11,62.41 270 top
R10  5k  [RESC1608X60]  10.9,22.79 90 top
R11  5k  [RESC1608X60]  14.45,22.71 90 top
R12  5k  [RESC1608X60]  17.93,22.76 90 top
R13  5k  [RESC1608X60]  21.31,22.71 90 top
R14  5k  [RESC1608X60]  24.79,22.69 90 top
R15  5k  [RESC1608X60]  28.35,22.69 90 top
R16  5k  [RESC1608X60]  31.9,22.69 90 top
R17  5k  [RESC1608X60]  35.43,22.69 90 top
R18  5k  [RESC1608X60]  38.99,22.69 90 top
R19  5k  [RESC1608X60]  44.12,22.84 90 top
R20  5k  [RESC1608X60]  47.65,22.79 90 top
R21  5k  [RESC1608X60]  51.03,22.82 90 top
R22  5k  [RESC1608X60]  54.41,22.76 90 top
R23  5k  [RESC1608X60]  57.76,22.76 90 top
R24  5k  [RESC1608X60]  61.19,22.82 90 top
R25  5k  [RESC1608X60]  64.59,22.79 90 top
R26  5k  [RESC1608X60]  68.1,22.74 90 top
R27  5k  [RESC1608X60]  73.18,22.71 90 top
R28  5k  [RESC1608X60]  76.76,22.64 90 top
R29  5k  [RESC1608X60]  80.27,22.64 90 top
R30  5k  [RESC1608X60]  83.75,22.64 90 top
R31  5k  [RESC1608X60]  87.15,22.64 90 top
R32  5k  [RESC1608X60]  90.63,22.64 90 top
R33  5k  [RESC1608X60]  94.06,22.61 90 top
R34  5k  [RESC1608X60]  97.54,22.61 90 top
R35  5k  [RESC1608X60]  104.24,22.66 90 top
R36  5k  [RESC1608X60]  107.75,22.74 90 top
R37  5k  [RESC1608X60]  111.28,22.76 90 top
R38  5k  [RESC1608X60]  114.68,22.69 90 top
R39  5k  [RESC1608X60]  118.11,22.74 90 top
R40  5k  [RESC1608X60]  121.54,22.69 90 top
R41  5k  [RESC1608X60]  124.92,22.66 90 top
R42  5k  [RESC1608X60]  128.35,22.71 90 top
R43  5k  [RESC1608X60]  134.34,22.61 90 top
R44  5k  [RESC1608X60]  137.82,22.69 90 top
R45  5k  [RESC1608X60]  141.3,22.69 90 top
R46  5k  [RESC1608X60]  144.6,22.66 90 top
R47  5k  [RESC1608X60]  147.96,22.64 90 top
R48  5k  [RESC1608X60]  151.28,22.69 90 top
R49  5k  [RESC1608X60]  154.76,22.71 90 top
R50  5k  [RESC1608X60]  158.09,22.74 90 top
R51  5k  [RESC1608X60]  163.45,22.74 90 top
R52  5k  [RESC1608X60]  166.85,22.82 90 top
R53  5k  [RESC1608X60]  170.13,22.76 90 top
R54  5k  [RESC1608X60]  173.46,22.76 90 top
R55  5k  [RESC1608X60]  176.76,22.76 90 top
R56  5k  [RESC1608X60]  180.06,22.74 90 top
R57  5k  [RESC1608X60]  183.39,22.71 90 top
R58  5k  [RESC1608X60]  186.69,22.64 90 top
R59  5k  [RESC1608X60]  189.97,22.64 90 top
R61  10k  [RESC1608X60]  149.34,77.89 90 top
R62  1M  [RESC1608X60]  13.62,38.65 270 top
R63  1k  [RESC1608X60]  141.54,85.69 0 top
R64  470k  [RESC1608X60]  163.13,90.77 180 top
R65  1M  [RESC1608X60]  160.92,71.57 0 top
R66  1k  [RESC1608X60]  150.92,80.2 180 top
R67  0  [RESC1608X60]  150.03,85.72 0 top
R68  5k  [RESC1608X60]  91.97,14.76 90 top
R69  5k  [RESC1608X60]  95.38,14.74 90 top
R70  5k  [RESC1608X60]  98.71,14.76 90 top
R71  5k  [RESC1608X60]  102.08,14.71 90 top
R72  5k  [RESC1608X60]  7.36,22.87 90 top
U1  ESP-07SESP-07S_RFS-L  [ESP-07S_RFS-L]  103.31,104.71 90 top
U2  TPS72325DBVTDBV0005A  [DBV0005A]  40.24,63.2 0 top
U3  TLV70012QDDCRQ1DDC5_TEX-L  [DDC5_TEX-L]  21.72,56.39 270 top
U4  AP2112K-3.3TRG1SOT_RG1_DIO-L  [SOT_RG1_DIO-L]  62.46,104.72 0 top
U5  LM2664M6  [SOT95P280X145-6N]  28.73,62.41 180 top
U6  AP2112K-3.3TRG1SOT_RG1_DIO-L  [SOT_RG1_DIO-L]  18.98,62.38 0 top
U7  LIS3DHHTRQFN  [QFN_ICLX_STM]  84.34,74.86 180 top
U8  ADS1194CPAGPAG64-L  [PAG64-L]  173.06,41.8 90 top
U9  ADS1194CPAGPAG64-L  [PAG64-L]  144.23,41.93 90 top
U10  ADS1194CPAGPAG64-L  [PAG64-L]  114.25,41.98 90 top
U11  ADS1194CPAGPAG64-L  [PAG64-L]  83.42,42.03 90 top
U12  ADS1194CPAGPAG64-L  [PAG64-L]  54.06,42.1 90 top
U13  ADS1194CPAGPAG64-L  [PAG64-L]  24.54,42.01 90 top
U14  TPD4E1B  [DCK6_TEX-L]  13.82,18.24 270 bottom
U15  TPD4E1B  [DCK6_TEX-L]  31.34,18.24 270 bottom
U16  TPD4E1B  [DCK6_TEX-L]  43.64,18.37 270 bottom
U17  TPD4E1B  [DCK6_TEX-L]  60.58,18.29 270 bottom
U18  TPD4E1B  [DCK6_TEX-L]  72.7,18.4 270 bottom
U19  TPD4E1B  [DCK6_TEX-L]  89.97,18.4 270 bottom
U20  TPD4E1B  [DCK6_TEX-L]  103.63,18.27 270 bottom
U21  TPD4E1B  [DCK6_TEX-L]  120.85,18.24 270 bottom
U22  TPD4E1B  [DCK6_TEX-L]  133.66,18.45 270 bottom
U23  TPD4E1B  [DCK6_TEX-L]  150.29,18.47 270 bottom
U24  TPD4E1B  [DCK6_TEX-L]  162.79,18.42 270 bottom
U25  TPD4E1B  [DCK6_TEX-L]  179.17,18.4 270 bottom
U26  TPD4E1B  [DCK6_TEX-L]  187.22,18.37 270 bottom
U27  TPD4E1B  [DCK6_TEX-L]  7.38,18.25 90 bottom
U28  PIC32MX250F128D-50I/PTTQFP44_MC_MCH-L  [TQFP44_MC_MCH-L]  158.89,80.66 270 top
U30  TPD4E1B  [DCK6_TEX-L]  97.05,9.05 270 top
XTAL1  8M  [XTALRR488W45L1150T500H350B]  160.9,67.38 0 top

## Tracks (layer width: path | path; a pad name or v marks a point on that pad's centre or on a via)
1N  (via drill 0.28)
  Top 0.203: v183.41,21.85 183.41,21.9 R57.1
  Bottom 0.203: v183.41,21.85 183.41,20.95 U25.4 179.82,16.08 175.83,12.09 175.83,7 JP20.7
1P  (via drill 0.28)
  Top 0.203: R58.1 v186.67,21.82
  Bottom 0.203: v186.67,21.82 186.57,21.73 U26.1 185.28,19.41 177.15,11.28 JP20.8
2N  (via drill 0.28)
  Top 0.203: R55.1 v176.73,21.95
  Bottom 0.203: JP20.5 173.39,6.89 173.39,13.14 179.17,18.92 U25.2 179.17,19.89 177.11,21.95 v176.73,21.95
2P  (via drill 0.28)
  Top 0.203: R56.1 v180.06,21.93
  Bottom 0.203: v180.06,21.93 180.59,21.39 180.59,19.19 179.16,17.76 179.16,17.68 179.17,17.67 U25.5 179.17,16.99 174.61,12.43 JP20.6
3N  (via drill 0.28)
  Top 0.203: R53.1 170.11,21.93 v170.1,21.93
  Bottom 0.203: v170.1,21.93 170.1,20.73 166.75,17.39 U24.4 163.41,17.36 163.41,16.35 170.88,8.89 170.88,6.87 JP20.3
3P  (via drill 0.28)
  Top 0.203: R54.1 v173.43,21.95
  Bottom 0.203: v173.43,21.95 174.52,20.86 177.62,20.86 178.52,19.96 U25.1 176.72,19.43 172.07,14.78 JP20.4
3V3  (via drill 0.28, 0.28 layers 1-2)
  Top 0.203: 65.18,105.67 C19.1 | v110.31,103.44 U1.8 | 97.92,94.85 R1.2 v97.92,94.59 | D2.A 111.37,126.17 v111.38,126.16 | R2.2 101.92,94.53 v101.91,94.54 | R4.2 106.29,118.81 106.24,118.86 v106.29,118.91
  Top 0.61: U4.5 65.18,105.67
  Route2 0.61: C19.1 78.27,105.6 78.34,105.66
  Bottom 0.203: v110.31,103.44 C22.1 108.12,103.5 C23.1
  other vias: 65.26,105.6
  pour Route2: 90.13,89 108.41,89 116.34,96.93 116.34,127.2 112.6,130.94 80.5,130.94 76.97,127.4 76.97,102.16
4N  (via drill 0.28)
  Top 0.203: R51.1 163.43,21.92 v163.43,21.95
  Bottom 0.203: JP20.1 166.98,5.67 161.54,11.11 161.54,17.79 162.74,19 162.74,19.41 U24.2 162.81,19.48 162.81,21.36 163.41,21.95 v163.43,21.95
4P  (via drill 0.28)
  Top 0.203: v166.88,22 R52.1
  Bottom 0.203: JP20.2 167.91,8.21 162.79,13.33 U24.5 162.79,17.89 166.88,21.98 v166.88,22
5N  (via drill 0.28)
  Top 0.203: v154.76,21.87 154.77,21.89 R49.1
  Bottom 0.203: v154.76,21.87 154.76,21.27 150.94,17.46 U23.4 150.94,16.19 147.57,12.81 147.57,6.87 JP21.7
5P  (via drill 0.28)
  Top 0.203: R50.1 v158.06,21.9
  Bottom 0.203: v158.06,21.9 159.28,20.68 161.73,20.68 162.14,20.27 U24.1 156.29,19.46 148.81,11.98 JP21.8
6N  (via drill 0.28)
  Top 0.203: R47.1 v147.96,21.8
  Bottom 0.203: JP21.5 145.05,6.85 145.05,13.98 150.29,19.22 U23.2 150.29,20.14 148.64,21.8 v147.96,21.8
6P  (via drill 0.28)
  Top 0.203: R48.1 v151.28,21.85
  Bottom 0.203: v151.28,21.85 151.49,21.85 151.69,21.65 151.69,19.21 150.31,17.83 150.31,17.45 U23.5 150.29,17.11 146.27,13.09 JP21.6
7N  (via drill 0.28)
  Top 0.203: R45.1 v141.29,21.86
  Bottom 0.203: v141.29,21.86 141.29,20.97 137.74,17.41 U22.4 134.31,16.74 142.46,8.59 142.46,6.9 JP21.3
7P  (via drill 0.28)
  Top 0.203: R46.1 v144.6,21.82
  Bottom 0.203: v144.6,21.82 144.6,21.16 145.37,20.4 149.26,20.4 149.64,20.02 U23.1 148.03,19.51 143.73,15.21 JP21.4
8N  (via drill 0.28)
  Top 0.203: R43.1 134.34,21.77 v134.32,21.77
  Bottom 0.203: v134.32,21.77 134.3,21.77 133.66,21.13 U22.2 133.67,19.23 132.23,17.79 132.23,11.9 138.53,5.6 141.17,5.6 JP21.1
8P  (via drill 0.28)
  Top 0.203: R44.1 v137.82,21.85
  Bottom 0.203: JP21.2 139.31,8.17 133.66,13.82 U22.5 133.66,17.67 137.82,21.83 v137.82,21.85
9N  (via drill 0.28)
  Top 0.203: v124.91,21.86 R41.1
  Bottom 0.203: v124.91,21.86 124.91,20.61 U21.4 121.5,16.14 117.44,12.08 117.44,7 JP1.7
9P  (via drill 0.28)
  Top 0.203: R42.1 v128.32,21.9
  Bottom 0.203: U22.1 133.01,19.51 | 133.01,19.51 133.01,20.39 131.5,21.9 v128.32,21.9 | JP1.8 118.76,11.67 126.57,19.48 132.98,19.48 133.01,19.51
10N  (via drill 0.28)
  Top 0.203: v118.11,21.9 R39.1
  Bottom 0.203: JP1.5 114.9,7 114.9,12.92 120.85,18.87 U21.2 120.85,19.81 118.77,21.9 v118.11,21.9
10P  (via drill 0.28)
  Top 0.203: R40.1 v121.52,21.87 v121.52,21.88
  Bottom 0.203: v121.52,21.88 121.74,21.65 122.24,21.15 122.24,18.86 120.85,17.47 U21.5 120.85,16.94 116.22,12.31 JP1.6
11N  (via drill 0.28)
  Top 0.203: R37.1 v111.27,21.94 v111.27,21.93
  Bottom 0.203: v111.27,21.93 111.27,20.84 107.69,17.26 104.31,17.26 U20.4 104.28,16.7 112.41,8.57 112.41,6.95 JP1.3
11P  (via drill 0.28)
  Top 0.203: R38.1 v114.68,21.88
  Bottom 0.203: v114.68,21.88 114.68,21.85 116.21,20.32 119.77,20.32 120.2,19.89 U21.1 119.27,19.28 113.68,13.69 JP1.4
12N  (via drill 0.28)
  Top 0.203: R35.1 v104.22,21.88
  Bottom 0.203: v104.22,21.88 104.19,21.88 103.64,21.33 103.64,19.31 | 103.64,19.31 U20.2 | JP1.1 108.6,5.68 102.25,12.03 102.25,17.67 103.64,19.06 103.64,19.31
12P  (via drill 0.28)
  Top 0.203: R36.1 107.72,21.95 v107.69,21.99
  Bottom 0.203: JP1.2 109.42,8.22 103.63,14 U20.5 103.63,17.74 107.69,21.8 v107.69,21.99
13N  (via drill 0.28)
  Top 0.203: R33.1 | R33.1 v94.1,21.8
  Bottom 0.203: v94.1,21.8 94.08,21.77 94.08,20.82 U19.4 90.62,16.01 86.68,12.08 86.68,6.85 JP22.7
13P  (via drill 0.28)
  Top 0.203: v97.54,21.79 R34.1
  Bottom 0.203: v97.54,21.79 101.4,21.79 102.98,20.21 U20.1 102.96,19.32 95.61,19.32 87.95,11.67 JP22.8
14N  (via drill 0.28)
  Top 0.203: v87.17,21.85 87.15,21.83 R31.1
  Bottom 0.203: JP22.5 84.14,6.85 84.14,13.22 89.97,19.05 U19.2 89.97,19.94 88.11,21.8 87.22,21.8 v87.17,21.85
14P  (via drill 0.28)
  Top 0.203: v90.62,21.8 v90.63,21.8 R32.1
  Bottom 0.203: v90.62,21.8 v90.63,21.8 91.36,21.07 91.36,19.01 89.96,17.61 89.96,17.38 89.95,17.37 U19.5 89.97,16.91 85.41,12.36 JP22.6
15N  (via drill 0.28)
  Top 0.203: v80.26,21.83 R29.1
  Bottom 0.203: U18.4 | U18.4 76.65,17.36 80.26,20.97 v80.26,21.83 | JP22.3 81.55,6.9 81.55,8.6 73.35,16.8 U18.4
15P  (via drill 0.28)
  Top 0.203: R30.1 v83.74,21.82
  Bottom 0.203: v83.74,21.82 84.81,20.76 88.58,20.76 89.32,20.02 U19.1 89.31,19.44 88.13,19.44 82.87,14.18 JP22.4
16N  (via drill 0.28)
  Top 0.203: R27.1
  Bottom 0.203: R27.1 72.7,21.42 U18.2 72.7,19.15 71.39,17.84 71.39,11.19 77.01,5.58 JP22.1
  other vias: 73.18,21.9
16P  (via drill 0.28)
  Top 0.203: R28.1 v76.75,21.82
  Bottom 0.203: JP22.2 78.38,8.12 72.7,13.8 U18.5 72.71,17.38 72.71,17.78 v76.75,21.82
17N  (via drill 0.28)
  Top 0.203: v64.61,21.98 64.61,21.96 R25.1
  Bottom 0.203: v64.61,21.98 64.59,21.96 64.59,18.88 62.97,17.26 U17.4 61.23,15.81 57.42,12 57.42,6.67 JP2.7
17P  (via drill 0.28)
  Top 0.203: R26.1 v68.1,21.93
  Bottom 0.203: v68.1,21.93 70.97,21.93 72.06,20.84 72.06,19.43 U18.1 66.38,19.43 58.62,11.67 JP2.8
18N  (via drill 0.28)
  Top 0.203: R23.1
  Bottom 0.203: R23.1 57.77,21.96 58.33,21.96 60.58,19.71 U17.2 60.58,18.82 54.78,13.02 54.78,6.77 JP2.5
  other vias: 57.76,21.95
18P  (via drill 0.28)
  Top 0.203: v61.22,22.03 R24.1
  Bottom 0.203: v61.22,22.03 61.87,21.38 61.87,18.8 60.57,17.51 U17.5 60.58,16.63 56.08,12.13 JP2.6
19N  (via drill 0.28)
  Top 0.203: R21.1 v51.02,21.98
  Bottom 0.203: v51.02,21.98 51.02,20.99 47.36,17.34 U16.4 44.29,16.73 52.27,8.75 52.27,6.74 JP2.3
19P  (via drill 0.28)
  Top 0.203: R22.1
  Bottom 0.203: R22.1 54.41,21.54 55.5,20.45 59.27,20.45 59.93,19.79 U17.1 59.88,19.27 59.88,18.69 59.5,18.31 57.3,18.31 53.54,14.55 JP2.4
  other vias: 54.41,21.95
20N  (via drill 0.28)
  Top 0.203: R19.1 v44.15,22.03
  Bottom 0.203: v44.15,22.03 43.62,21.5 43.62,19.43 U16.2 43.64,18.97 42.34,17.67 42.34,10.73 47.59,5.47 JP2.1
20P  (via drill 0.28)
  Top 0.203: v47.65,21.98
  Bottom 0.203: JP2.2 48.69,8.01 43.64,13.06 U16.5 43.64,17.85 47.65,21.86 v47.65,21.98
21N  (via drill 0.28)
  Top 0.203: v35.43,21.88 R17.1
  Bottom 0.203: v35.43,21.88 35.4,21.86 35.4,20.66 32,17.26 U15.4 32,15.66 27.88,11.54 27.88,6.82 JP3.7
21P  (via drill 0.28)
  Top 0.203: R18.1 v38.99,21.85
  Bottom 0.203: v38.99,21.85 41.78,21.85 42.99,20.65 U16.1 42.99,19.38 36.78,19.38 29.08,11.67 JP3.8
22N  (via drill 0.28)
  Top 0.203: v28.37,21.88 v28.37,21.87 R15.1
  Bottom 0.203: JP3.5 25.29,6.87 25.29,12.92 31.34,18.97 U15.2 31.29,19.33 31.29,19.94 31.29,19.95 31.29,20.02 29.43,21.88 v28.37,21.88
22P  (via drill 0.28)
  Top 0.203: R16.1 v31.9,21.88
  Bottom 0.203: JP3.6 26.54,11.06 31.34,15.87 U15.5 31.33,17.45 32.66,18.78 32.66,20.52 31.9,21.27 v31.9,21.88
23N  (via drill 0.28)
  Top 0.203: R13.1 v21.3,21.88
  Bottom 0.203: JP3.3 22.7,6.92 22.7,8.78 14.47,17.01 U14.4 14.47,17.72 17.11,20.36 20.41,20.36 21.3,21.25 v21.3,21.88
23P  (via drill 0.28)
  Top 0.203: v24.79,21.88 R14.1
  Bottom 0.203: v24.79,21.88 24.82,21.88 25.89,20.8 29.93,20.8 30.7,20.04 U15.1 30.68,19.26 30.68,18.92 24,12.24 JP3.4
24N  (via drill 0.28)
  Top 0.203: v14.41,21.91 14.43,21.9 R11.1
  Bottom 0.203: v14.41,21.91 13.8,21.3 13.8,19.29 U14.2 13.82,18.97 12.46,17.61 12.46,11.09 17.93,5.63 JP3.1
24P  (via drill 0.28)
  Top 0.203: R12.1
  Bottom 0.203: JP3.2 19.04,8.17 13.82,13.39 U14.5 13.82,17.72 17.93,21.84 R12.1
  other vias: 17.93,21.95
-RAW
  Top 0.203: 38.86,62.42 U2.3 | 31.64,62.41 C11.1
  Top 0.406: C4.1 38.86,62.42
  Top 0.61: U2.3 U2.2 | U5.2 31.64,62.41 | C4.1 31.88,62.42 C11.1
AGND  (via drill 0.28, 0.28 layers 1-15)
  Top 0.203: R10.2 10.88,23.62 C74.1 | U9.49 138.55,46.13 v139.37,46.96 v139.38,46.96 | U11.49 77.73,45.79 77.73,46 v78.64,46.91 | C156.2 8.86,25.18 | C155.2 | C154.2 | C153.2 100.26,17.08 100.27,17.08 | 103.62,17.08 C152.2 | C74.2 | C73.2 15.99,25.14 16.02,25.11 | C72.2 19.47,25.11 19.5,25.08 | C79.2 22.83,25.11 | C78.2 26.33,25.11 | 29.91,25.13 C77.2 | C76.2 | C83.2 36.95,25.16 | C82.2 40.55,25.03 40.53,25.01 | 45.69,25.11 C81.2 | 49.19,25.11 C80.2 | C87.2 | 55.98,25.13 55.97,25.13 C86.2 | C85.2 59.33,25.13 | C84.2 62.7,25.16 62.68,25.18 | 66.16,25.16 66.15,25.15 C91.2 | 69.67,25.13 C90.2 | 74.72,25.08 74.7,25.1 C89.2 | C88.2 78.3,25.03 78.33,25.03 | C95.2 81.8,25.09 81.81,25.08 | C92.2 92.19,25.1 92.2,25.09 | C96.2 109.31,25.01 | C103.2 112.81,25.04 112.82,25.03 | C102.2 116.2,25.03 | C100.2 123.13,25.08 | 126.48,25.06 C107.2 | C106.2 129.86,25.06 | C105.2 135.87,25.02 135.86,25.03 | C104.2 139.34,25.03 | C109.2 149.47,25.06 | 152.9,25.06 152.88,25.08 C108.2 | C115.2 156.26,25.06 156.25,25.06 | C114.2 159.63,25.08 | C113.2 164.97,25.08 | C119.2 171.69,25.05 171.65,25.01 | 175.08,25.08 175.07,25.08 C118.2 | 178.38,25.08 178.37,25.08 C117.2 | 181.68,25.08 181.67,25.08 C116.2 | C123.2 | 188.26,25.08 188.25,25.08 C122.2 | U8.33 176.81,48.68 v177.07,48.95 | U8.52 U8.51 165.59,44.55 v165.44,44.7 | U9.52 U9.51 136.78,44.68 v136.5,44.96 | U10.33 118,48.4 v118.7,49.1 | U10.52 U10.51 106.55,44.73 | U11.33 87.17,48.45 v87.86,49.15 | U11.52 U11.51 v76.04,44.78 v76.03,44.79 | U8.31 177.35,45.05 v177.34,45.06 | U12.33 57.81,48.53 v58.5,49.23 | U12.52 U12.51 46.89,44.85 46.59,45.16 | U13.33 29.23,48.62 v29.75,48.62 | 168.4,25.08 C112.2 | C110.2 146.1,25.05 146.12,25.03 | C111.2 | U8.49 167.39,45.56 167.39,46 v168.15,46.76
  Top 0.203: C97.2 105.78,25.04 | U10.49 108.58,46.16 v109.4,46.99 | U11.31 89.08,45.26 88,45.26 v87.93,45.19 | 99.1,25.06 99.08,25.08 C98.2 | C93.2 88.67,25.07 | C94.2 85.33,25.1 85.34,25.11 | 95.6,25.06 C99.2 | U30.3 96.41,10.58 v95.96,11.02 | v19.69,47.11 19.69,46.58 U13.49 | U13.31 29.1,45.26 v28.89,45.47 | JP12.7 188.47,75.95 188.47,61.92 v188.5,61.92 | U12.49 48.38,46.42 49.19,47.24 v49.22,47.24 | 107.27,40.62 107.27,40.65 | U9.31 148.96,45.18 148.7,45.44 | U10.31 118.58,45.23 v118.56,45.24 | U13.60 17.85,40.26 v17.66,40.45 | U13.41 24.3,48.57 25.33,49.6 25.33,49.61 v25.6,49.89 | 119.67,25.04 119.65,25.06 C101.2 | U12.31 59.65,45.27 59.03,45.27 58.58,44.82 v58.58,44.71 | C11.2 31.78,60.74 | 49.1,120.11 49.1,120.12 | U13.51 17.09,44.76 v16.97,44.88
  Top 0.457: v21.21,59.11 21.21,58.78 21.72,58.27 U3.2 | C5.2 20.96,53.4 20.96,53.37
  Top 0.61: C2.2 39.04,65.06 U2.1 | U5.1 30.7,60.74 31.78,60.74 | JP23.2 49.1,120.11 | FB3.2 48.67,98.07 | FB5.2 48.72,80.47 | FB2.2 59.03,56.05 59.05,56.03 | FB6.2 89.11,56.15 89.13,56.13 | FB9.2 123.73,56.23 123.75,56.21 | FB1.2 156.16,56.13 156.19,56.11
  Route15 0.203: v188.5,61.92 188.5,56.16 188.99,55.68 JP8.2
  Bottom 0.203: 103.89,44.61 C216.2 103.74,44.83 | 136.5,44.84 C187.2 136.5,44.89 v136.5,44.96 | 43.9,45.17 C246.2 | C145.2 164.98,36.78 | 154.23,44.86 C184.2 | 154.26,41.28 C166.2 154.28,41.27 154.27,41.29 | 143.6,40.84 C178.2 143.59,40.82 | 141.82,36.09 141.85,36.09 C176.2 141.88,36.03 141.86,36.02 | C170.2 133.87,42.88 133.86,42.88 | C168.2 154.29,35.94 154.28,35.94 | 152.74,48.64 C182.2 | 145.88,44.07 C174.2 144.77,44.09 144.75,44.07 | 122.84,48.64 C210.2 122.89,48.67 | 111.47,36.74 C192.2 111.99,36.22 | C194.2 106.35,37.03 106.33,37.03 | C198.2 103.69,42.82 | 105.19,48.79 105.18,48.78 | C206.2 113.62,40.74 | 124.67,35.97 C202.2 | C208.2 124.64,41.26 124.66,41.26 | 73.54,43.28 C226.2 | 93.53,45.06 C240.2 93.57,45.1 93.57,45.11 | 93.55,41.41 C222.2 93.61,41.48 93.59,41.47 | 93.58,36.05 C224.2 | 85.34,44.06 C232.2 85.19,44.1 85.15,44.06 | 82.72,40.96 C233.2 82.71,40.85 82.71,40.84 | 81.14,36.09 C230.2 81.22,36.09 81.23,36.07 | 74.48,48.79 74.47,48.8 C218.2 | C238.2 92.06,48.79 | C236.2 75.61,37.12 75.59,37.13 | 43.84,43.31 C254.2 | 62.54,48.62 C268.2 | 64.34,41.74 C250.2 64.36,41.74 | 55.57,44.14 C248.2 55.58,44.15 55.58,44.12 | 53.46,41.11 C262.2 53.45,41.08 53.45,41.05 | 45.71,37.91 C264.2 46.28,37.34 | C258.2 51.78,36.11 51.8,36.09 | C252.2 64.34,36.09 | 45.12,49.1 C272.2 | C266.2 64.41,45.38 | 14.46,42.98 C282.2 | 33.05,48.77 C294.2 33.1,48.74 | 34.53,45.19 C296.2 | 34.58,41.48 C278.2 34.59,41.49 | 34.53,35.92 C280.2 | 16.68,37.36 C290.2 16.67,37.31 | 21.86,36.57 C288.2 22.36,36.07 | C274.2 | C292.2 23.92,40.85 23.92,40.84 | C300.2 15.72,48.64 | C27.2 | C197.2 106.33,42.83 | C220.2 85.26,37.2 | C212.2 124.61,44.88 | C217.2 78.62,47.09 78.64,47.06 v78.64,46.91
  Bottom 0.203: C244.2 | C299.2 19.69,47.13 v19.69,47.11 | 46.59,45.16 46.57,45.16 C245.2 | C215.2 106.44,44.68 106.5,44.68 | C243.2 v76.03,44.79 | C29.2 162.87,44.71 162.87,44.7 | C263.2 46.25,39.64 45.23,39.64 45.19,39.6 | C239.2 | C183.2 151.82,44.86 | 115.84,44.03 115.85,44.03 C204.2 114.84,44.03 114.78,44.09 | C161.2 v139.38,46.96 | C189.2 109.41,46.99 v109.4,46.99 | v49.22,47.24 49.21,47.22 C271.2 | C295.2 31.92,45.19 | C277.2 31.96,41.54 | C139.2 181.34,48.49 | C141.2 183.16,44.99 183.14,44.96 | 174.75,44.12 174.75,44.11 C135.2 173.58,44.09 | C159.2 v168.15,46.76 | C160.2 164.05,48.61 | C28.2 v165.44,44.7 | C235.2 75.54,39.42 74.3,39.42 | C193.2 105.07,39.28 105.05,39.27 | C144.2 164.95,39.22 163.83,39.22 | C179.2 135.26,39.28 135.23,39.32 | C273.2 v16.97,44.88
  other vias: 67.28,35.03 73.05,32.72 125.09,33.17 72.14,37.72 7.59,32.33 20.73,34.24 63.2,32.16 94.79,33.5 99.01,37.8 100.28,41.81 70.41,41.55 38.25,41.53 42.75,32.26 35.23,32.41 39.83,38.2 50.47,34.29 79.07,33.63 103.1,30.48 106.78,34.37 132.11,29.87 129.87,38.02 129.72,41.73 154.08,32.03 160.58,32 167.31,32.99 160.5,37.41 159.21,41.76 183.16,32.13 191.11,35.97 191.19,29.08 135.48,51.46 106.35,44.76 35.43,13.74 39.42,13.72 35.43,8.97 39.52,8.97 64.92,14.05 68.91,14.02 64.92,9.27 69.01,9.27 125.53,14.48 129.51,14.45 125.53,9.7 129.62,9.7 155.09,13.64 159.08,13.61 155.09,8.86 159.18,8.86 13.31,28.91 193.01,17.12 192.99,12.09 3.02,26.97 3.1,16.05 2.87,40.16 2.77,50.77 8.61,45.47 8.59,50.83 35.28,51.69 40.26,50.27 70.64,50.09 66.01,51.82 101.04,50.47 109.45,51.66 123.04,51.31 129.36,51.28 151.59,51.41 159.72,51.77 180.59,52.07 185.88,52.07 191.13,48.46 191.13,42.93 22.15,66.24 9.65,62.26 34.39,66.07 46.28,65.96 46.13,112.73 46.02,89.18 46.23,74.9 167.59,55.47 150.47,55.8 128.65,55.98 82.85,54.66 67.84,55.68 32.61,55.32 46.41,101.98 35.53,4.55 39.42,4.27 102.64,8.18 65.1,4.04 68.96,4.04 125.63,3.78 129.74,3.68 52.45,55.42 164.29,51.69 105.31,51.64 74.75,51.69 45.34,51.28 15.9,52.48 155.22,4.47 159.38,4.11 45.77,118.49 48.16,115.27 44.2,115.16 44.3,108.18 47.47,108.41 44.58,104.27 45.16,99.24 45.44,94.31 48.13,93.83 48.08,87.58 45.39,84.33 45.16,79.55 44.27,71.3 39.65,70.51 32.59,70.08 27.97,70.23 19.1,70.76 11.28,71.04 6.71,70.59 22.81,70.38 35.79,70.71 47.7,71.91 44.4,129.59 48.62,127.2 43.89,127.13 44.22,120.27 48.49,123.77 39.19,34.14 39.04,30.66 16.99,30.56 11.3,34.54 21.84,30.76 23.62,32.59 19.58,28.75 23.42,28.8 29.01,29.82 30.68,28.24 34.16,28.35 32.03,30.28 29.79,32.64 18.67,32.56 15.06,31.7 7.98,29.82 2.82,30.28 2.72,45.29 3.68,54.71 7.67,55.32 11.94,55.42 12.57,50.01 11.46,47.4 5.84,47.6 2.16,37.21 1.91,24.41 2.13,20.98 1.98,17.75 1.98,13.49 2.06,10.57 3.76,7.59 7.77,3.61 10.39,2.21 13.82,1.98 17.27,2.06 22.94,1.68 28.96,1.98 33.45,1.91 36.78,1.88 41.02,1.91 44.73,1.88 48.69,1.96 52.91,2.21 56.44,2.08 59.54,1.83 63.27,1.83 67.61,2.21 71.96,2.16 77.01,2.21 82.78,2.11 89.28,1.88 92.08,2.21 96.47,2.21 99.85,2.18 103.66,2.16 107.44,2.31 111.86,2.34 116.15,2.16 120.7,2.26 127.33,2.26 133.02,2.31 137.01,2.39 142.32,2.39 146.18,2.39 151.46,2.29 154.99,2.13 158.32,2.29 161.49,2.26 164.08,2.31 167.26,2.39 170.54,2.26 173.48,2.18 176.81,2.26 179.91,2.11 181.89,2.44 185.9,2.59 188.62,3.4 191.31,6.27 193.4,8.59 195.5,10.41 195.43,13.87 195.35,17.55 195.5,19.96 195.38,24.28 195.5,27.05 195.43,30.4 195.45,34.82 195.48,37.44 195.68,42.72 195.43,46.51 195.45,50.06 195.02,53.24 194.74,55.7 185.8,56.03 182.58,56.11 179.32,55.85 183.08,53.7 187.1,54.15 188.39,51 186.59,48.36 183.9,51.56 178.66,53.77 178.97,50.95 193.12,50.75 193.57,47.75 193.29,44.65 191.06,46.15 188.65,47.68 193.12,41.66 188.65,41.27 188.14,37.44 188.09,34.21 192.25,32.51 188.98,31.22 186.59,29.77 180.82,33.71 186.06,32.51 182.27,28.04 180.8,29.21 179.25,30.78 177.67,32.49 177.11,30.18 178.23,29.03 179.27,28.02 173.35,30.12 171.91,28.57 173.99,27.79 176.25,27.69 171.96,31.7 170.41,30.48 169.11,29.13 169.72,33.73 166.14,30.66 163.12,28.47 164.24,33.12 163.19,31.04 161.04,29.82 160.58,35.48 157.71,34.62 157.81,31.39 162.48,34.04 158.06,28.8 160.88,23.14 165.1,22.76 168.38,22.81 171.6,22.81 175.11,22.83 178.38,22.78 181.81,22.68 185.27,22.66 188.29,22.61 191.77,22.91 156.44,22.66 153.06,22.66 149.71,22.63 146.3,22.58 142.98,22.78 139.47,22.73 135.97,22.53 131.27,23.22 126.64,22.76 123.19,22.83 119.61,22.78 116.28,23.16 112.83,22.89 109.47,22.76 106.15,22.83 102.51,22.68 100.15,22.91 95.96,22.66 92.18,22.48 89.03,22.68 85.42,22.73 82.12,22.56 78.54,22.58 75.26,23.6 71.7,22.89 69.9,22.99 71.4,24.94 66.37,23.04 62.81,22.83 59.44,22.81 55.93,22.86 52.78,22.89 49.38,22.71 45.9,22.83 41.61,23.11 37.08,22.71 33.6,22.91 30.28,23.16 26.64,22.86 22.83,22.94 19.56,22.68 16.18,22.81 12.52,22.99 9.04,22.86 18.49,18.72 16.48,17.58 18.95,15.52 36.6,15.88 39.07,18.06 45.06,13.64 48.44,15.6 42.55,6.48 12.93,6.4 15.04,10.49 16.51,8.71 18.54,7.14 15.8,4.57 11.07,8.59 10.79,14.55 68.4,16.71 52.12,18.34 49.86,17.73 54.71,18.21 52.43,15.6 46.76,18.59 40.89,16.64 38.76,15.85 37.54,13.23 44.68,10.08 46.61,8.59 48.59,6.58 48.87,9.55 38.35,6.55 33.43,6.71 37.41,9.98 41.76,8.48 45.09,4.88 42.57,3.81 22.78,14.96 22.56,17.6 25.27,17.2 25.32,27.97 27.58,27.91 33.12,33.45 30.07,35.76 9.55,32.08 13.08,35.05 11,28.6 12.65,30.68 15.7,29.01 47.93,31.8 45.9,29.84 43,35.23 42.09,38.23 37.06,34.34 52.63,32.13 51.16,30.56 49.94,29.13 54.13,29.74 52.68,28.47 54.99,27.97 57.15,27.84 58.01,30.07 59.13,28.75 60.38,27.51 63.3,28.02 61.95,29.29 60.3,30.94 58.8,32.64 53.72,33.4 59.51,35.18 61.37,33.6 65,29.97 66.75,28.5 72.19,27.91 70.31,30.1 68,32.18 74.45,29.84 76.56,31.42 70.31,34.59 69.29,37.67 73.84,35.38 81.31,31.6 80.01,30.12 78.46,28.5 81.74,28.35 83.26,29.84 84.28,27.97 86.44,28.04 89.94,27.81 88.93,28.7 87.5,30.15 87.78,32.87 89.2,31.62 90.53,30.33 92.1,28.68 96.77,27.89 95.2,29.26 93.52,30.86 92.08,32.44 90.35,34.16 88.65,35.69 92.86,34.06 95.94,31.34 97.64,29.82 97.38,32.72 98.68,34.95 96.44,35.43 101.47,38.1 103.33,34.16 100.74,32.36 101.9,26.31 100.05,29.41 105.92,28.6 106.38,31.22 110.36,33.02 108.46,31.95 103.81,35.84 104.5,32.16 107.44,30.18 109.27,28.65 110.59,29.77 112.14,31.14 113.64,32.77 112.78,28.3 114.2,29.84 118.16,30.23 119.71,28.83 119.23,32.72 120.7,30.94 122.25,29.54 115.11,27.81 117.35,27.97 122.22,33.63 123.55,31.85 126.16,29.26 119.89,35.31 128.47,28.8 131.72,25.81 134.39,28.47 137.06,30.07 139.04,31.83 140.77,33.38 139.4,28.42 140.79,29.67 142.14,31.29 143.74,32.82 144.45,30.05 143.03,28.09 145.14,27.79 147.37,27.84 149.86,28.12 148.49,29.59 148.59,32.97 150.09,31.62 151.28,30.3 152.58,28.93 155.93,28.83 155.12,29.95 152.43,32.72 150.01,34.87 135.31,31.04 133.55,33.1 134.62,35.99 132.11,34.98 130.4,31.42 127.28,31.32 130.53,33.4 127.64,35.28 157.91,37.13 161.62,25.3 161.62,27.76 160.27,21.77 132.61,24.38 130.91,20.7 94.16,12.29 93.09,10.85 100.1,12.17 103.76,12.06 106.86,12.24 107.98,8.26 105.79,4.27 102.59,5.23 99.26,5.23 100.18,8.23 94.79,6.48 96.67,4.85 93.47,4.75 70.33,20.6 66.29,16.69 62.33,13.67 61.29,11.46 66.98,6.71 72.54,5.66 74.52,10.29 76.4,8.2 74.6,4.67 71.65,7.87 74.19,14.3 75.87,12.88 78.41,13.64 76.61,15.19 78.16,16.87 78.87,15.49 69.67,18.21 81.79,18.72 84.15,18.82 86.56,19.33 81.58,14.02 75.64,18.8 100.3,20.6 92.79,7.19 90.32,10.62 85.95,2.26 107.11,15.88 109.45,16.97 107.24,19.18 109.8,13.69 112.34,14.27 114.96,17.09 112.45,19.41 117.4,19.15 111.38,11.53 121.18,11.07 123.22,14.07 126.34,17.2 128.91,18.21 124.64,15.95 130.71,17.17 127.89,12.88 131.93,9.22 130.33,12.17 127.56,8.79 124.31,8.41 128.12,5.26 132.11,5.23 135.56,5.23 139.12,3.38 123.93,3.4 138.2,15.44 140.11,17.65 140.03,14.38 142.44,14.35 142.34,17.2 137.03,19.08 144.98,18.69 142.42,19.1 153.59,18.47 157.28,17.96 159.87,18.21 155.4,16 153.97,11.73 157.71,11.05 162.61,7.09 158.19,6.35 154.81,6.58 153.47,3.63 149.48,2.31 144.25,3.17 136.98,8.92 135.05,10.9 135.13,14.27 138.89,10.24 165.91,16.28 167.79,14.86 168.43,16.79 158.72,16.23 173.28,18.26 170.74,17.88 170.92,15.01 166.27,18.75 183.03,18.95 181.71,17.22 182.3,10.34 183.49,12.88 184.81,14.53 183.77,10.64 184.2,6.32 163.73,4.27 166.09,8.26 163.45,11.15 164.59,13.39 191.57,13.34 193.9,15.29 190.78,15.11 190.42,18.41 192.35,19.94 28.55,52.55 30.53,55.73 28.5,55.88 25.65,55.75 16.23,55.68 11.91,53.09 7.01,52.58 1.93,54.23 1.83,47.57 1.85,43.43 5.26,50.57 5.89,44.83 35.59,55.88 37.77,55.93 41.73,55.91 45.36,55.8 48.69,55.93 50.52,55.91 60.73,56.08 62.53,56.06 55.19,56.06 69.39,52.04 68.1,50.55 63.53,51.89 60.4,51.89 71.4,52.83 78.11,52.22 80.16,52.68 80.04,54.94 78.41,54.99 74.68,55.04 70.46,55.24 90.25,54.84 93.45,54.89 96.49,54.89 99.95,54.97 102.54,52.48 99.34,52.48 96.04,52.4 93.37,52.5 90.42,52.32 97.66,50.34 108.69,54.81 110.74,54.86 105.61,54.89 102.46,54.97 111.96,52.7 110.57,50.57 108.36,52.81 115.57,51.71 113,54.79 114.88,56.08 118.97,56.16 121.69,56.24 120.47,52.37 124.23,52.68 127.41,51.54 126.31,55.7 131.47,55.52 133.02,52.76 129.44,52.83 132.28,50.27 128.27,49.5 138.33,52.7 135.25,56.13 135.74,54.94 138.46,56.34 139.98,55.14 141.5,56.06 143.41,55.09 144.48,56.18 146.46,56.06 154.08,56.26 158.09,56.11 160.55,56.06 164.39,55.65 172.64,56.24 175.21,56.11 167.87,52.37 157.58,52.58 154.48,50.85 152.78,52.93 150.14,53.06 161.16,52.91 161.54,50.67 160.27,44.88 160.4,46.58 160.58,48.62 172.64,38.38 143.79,38.25 141.12,44.83 170.33,46.05 83.26,38.58 68.25,41.33 53.57,37.92 24.08,38.53 20.83,44.73 21.92,45.92 11.15,43.92 5.23,42.82 4.8,38.28 37.67,50.47 42.32,52.25 38.73,52.12 33.4,52.07 31.9,51.66 30.48,50.57 26.29,51.26 25.27,53.72 21.13,51.26 19.41,51.28 19.43,54.94 48.23,51.97 50.01,51.56 55.24,49.91 55.55,51.87 38.28,36.75 40.21,41.43
  pour Top: 42.63,73.92 41.37,72.66 41.34,72.64 2.06,72.64 0.89,71.47 0.89,8.69 8.52,1.07 188,1.07 196.29,9.35 196.29,55.85 195.17,56.97 64.04,56.97 64.03,56.96 64,56.95 52.08,56.95 52.05,56.96 49.8,59.22 49.78,59.24 49.78,127.4 46.22,130.96 43.39,130.96 42.65,130.22 42.65,73.95
  pour Bottom: 42.61,73.92 41.39,72.71 41.37,72.69 2.04,72.69 0.86,71.52 0.86,8.69 8.52,1.04 187.93,1.04 196.32,9.43 196.32,55.8 195.12,57 64.04,57 64,56.96 63.97,56.95 52.11,56.95 52.08,56.96 49.82,59.22 49.81,59.24 49.81,127.4 46.22,130.99 43.39,130.99 42.62,130.22 42.62,73.95
AVDD  (via drill 0.28, 0.28 layers 1-2)